# Altium project vme6U_carrier_Cyc_V_SoC.PrjPcb (part 6 of 8)

## Sheet DDS.SchDoc
size 594 x 420 mm; Address1: Address1; Address2: Address2; Address3: Address3; Address4: Address4; SheetNumber: 1; Scale: 1:1; Разраб.: Иванов; Обозначение документа: АБВГ.123456.001 Э3; Пров.: Петров; Утв.: Сидоров; Наименование организации: ОАО "Концерн "МПО-Гидроприбор"; Перв. применение: АБВГ.123456.000; Наименование изделия 1: Плата; Наименование изделия 2: Схема электрическая; Наименование изделия 3: принципиальная; Нач. отд.: Нач. отд.; Фамилия нач. отд.: Сидоров
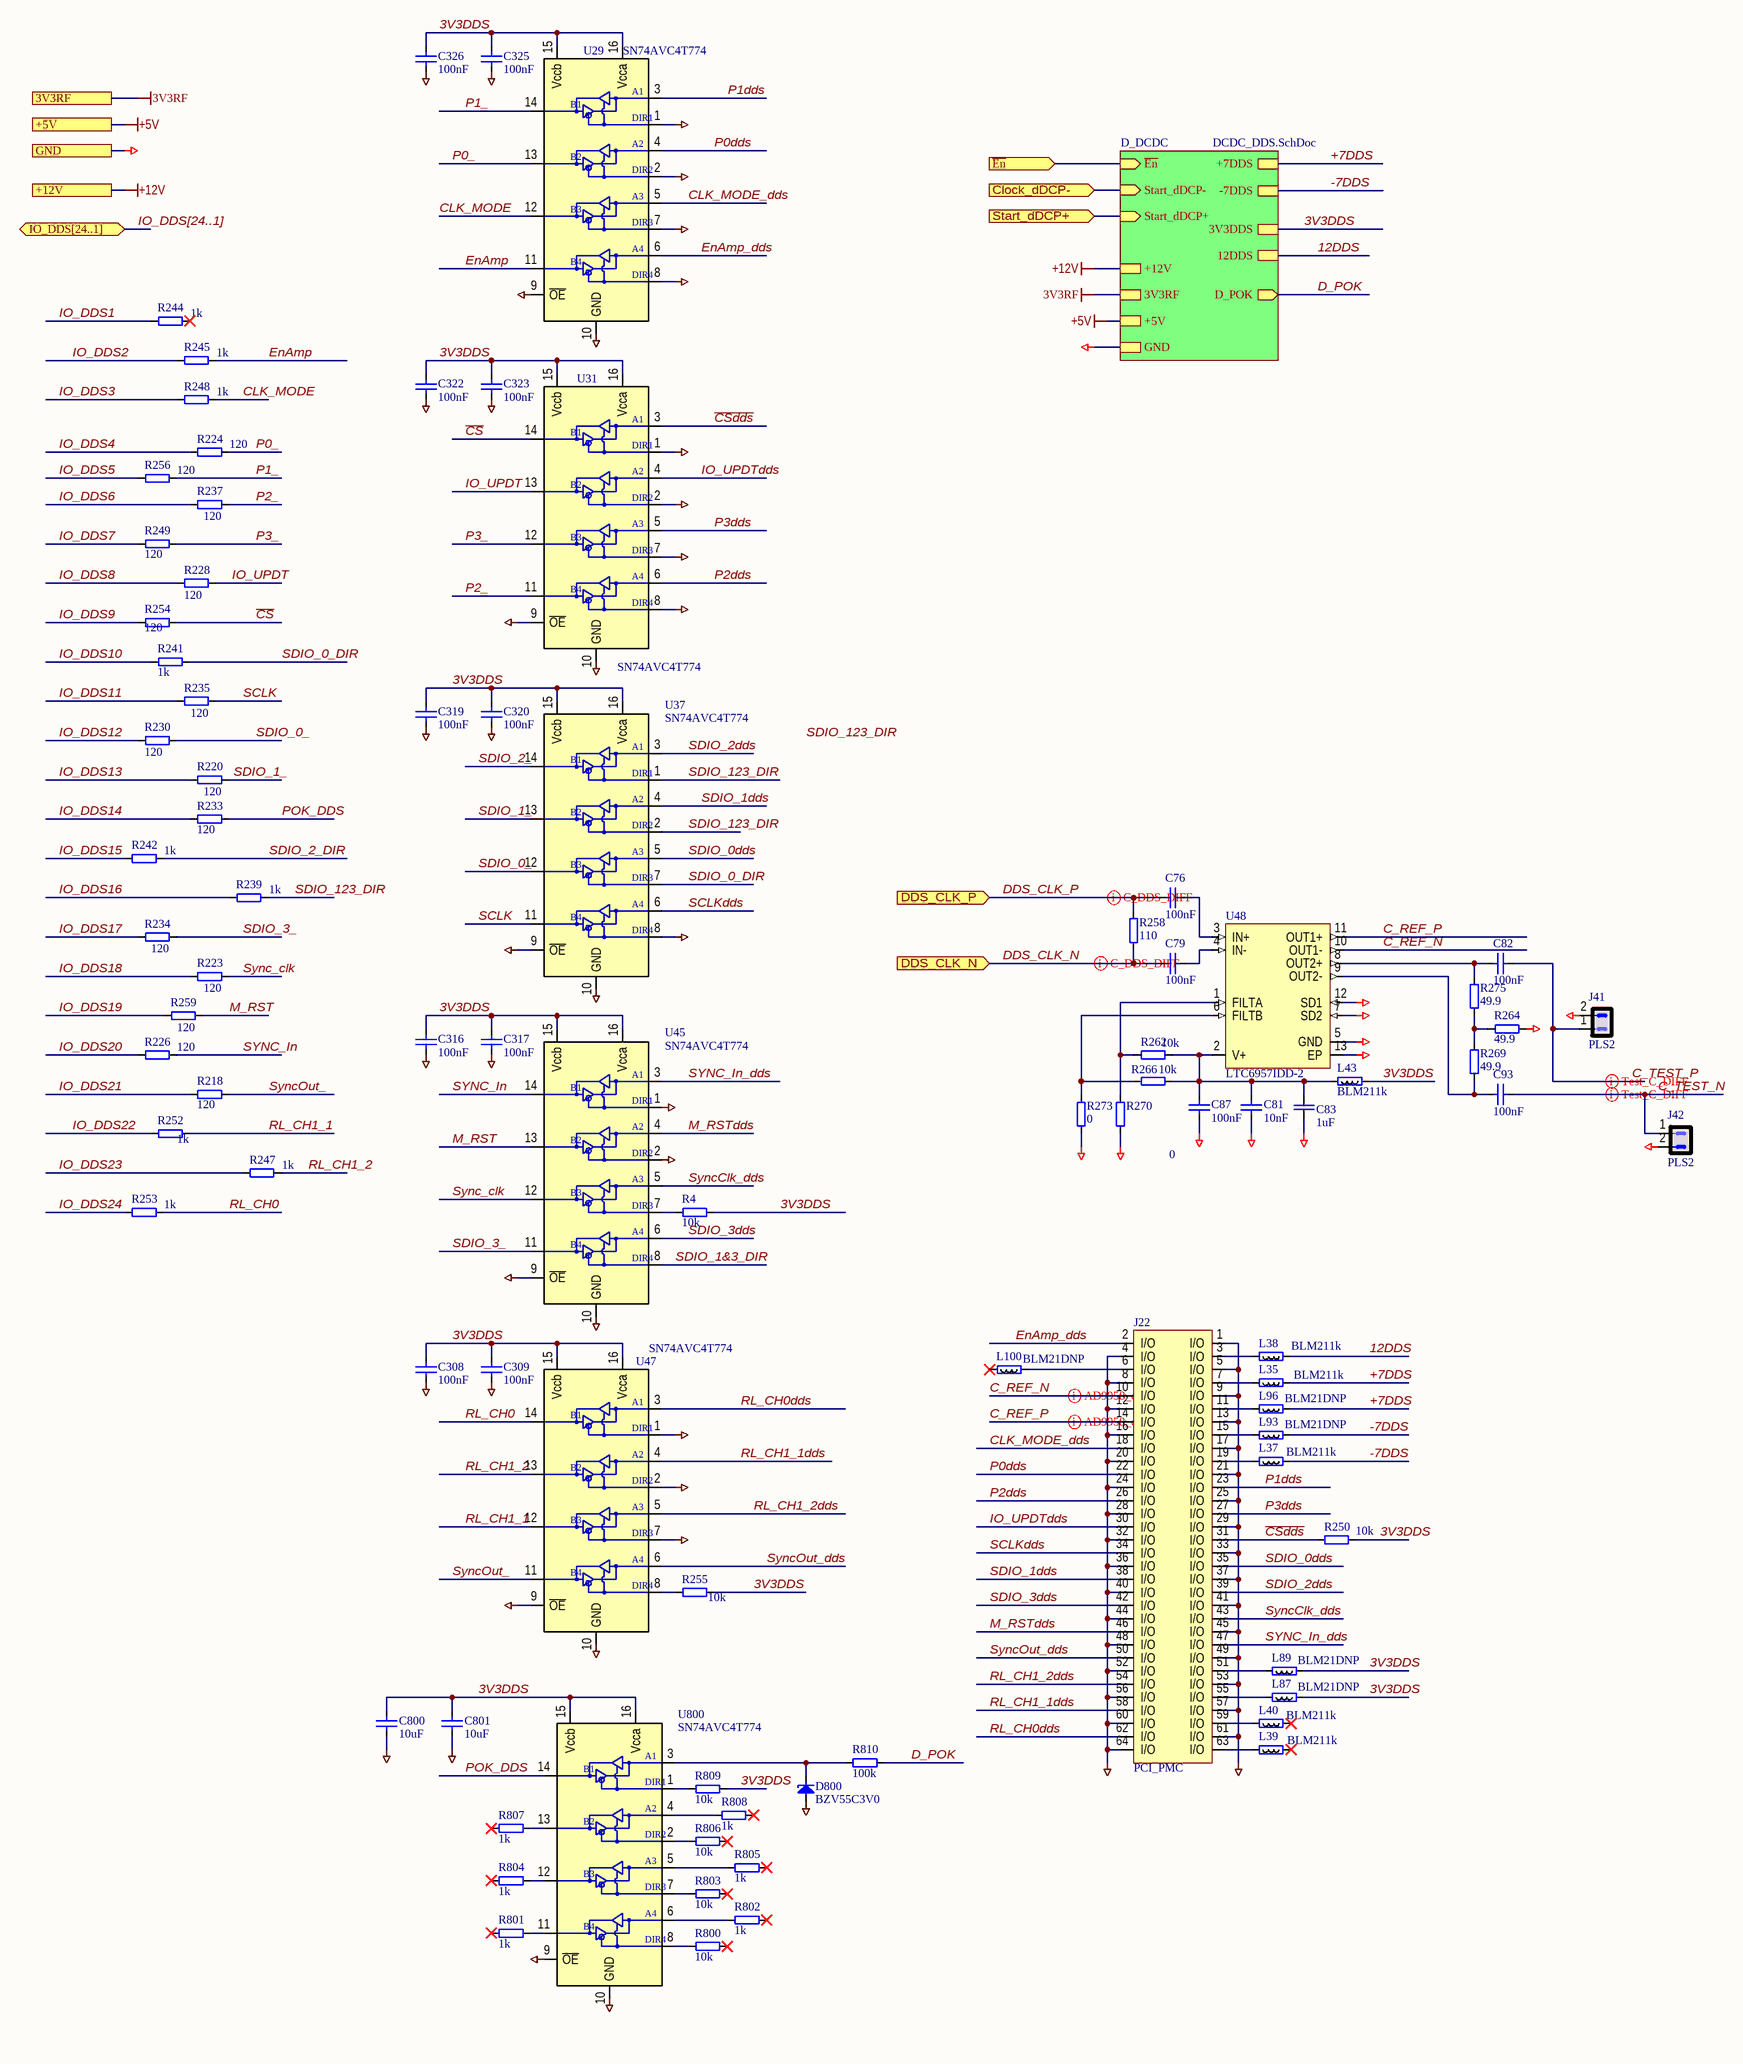
[diagram p21: DDS.SchDoc]

### Parts
(Parts that share a designator on the sheet are numbered #1, #2 ... from top to bottom, then left to right.)
C76#2  100nF  [CAPC1608X87N]
C79#2  100nF  [CAPC1608X87N]
C81#2  10nF  [CAPC1608X87N]
C82  100nF  [CAPC1608X87N]
C83  1uF  [0508]
C87  100nF  [CAPC1608X87N]
C93  100nF  [CAPC1608X87N]
C308  100nF  [SMD0805CAP]
C309  100nF  [SMD0805CAP]
C316  100nF  [SMD0805CAP]
C317  100nF  [SMD0805CAP]
C319  100nF  [SMD0805CAP]
C320  100nF  [SMD0805CAP]
C322  100nF  [SMD0805CAP]
C323  100nF  [SMD0805CAP]
C325  100nF  [SMD0805CAP]
C326  100nF  [SMD0805CAP]
C800  10uF  [SMD0805CAP]
C801  10uF  [SMD0805CAP]
D800  BZV55C3V0  [DIOMELF3516N]
J22  PCI_PMC  [TYCO_120521-1]
J41  PLS2  [PLS2]
J42  PLS2  [PLS2]
L35  BLM211k  [RESC2012X50N]
L37  BLM211k  [RESC2012X50N]
L38  BLM211k  [RESC2012X50N]
L39  BLM211k  [RESC2012X50N]
L40  BLM211k  [RESC2012X50N]
L43  BLM211k  [RESC2012X50N]
L87  BLM21DNP  [RESC2012X50N]
L89  BLM21DNP  [RESC2012X50N]
L93  BLM21DNP  [RESC2012X50N]
L96  BLM21DNP  [RESC2012X50N]
L100  BLM21DNP  [RESC2012X50N]
R4  10k  [SMD0805RES]
R218  120  [SMD0805RES]
R220  120  [SMD0805RES]
R223  120  [SMD0805RES]
R224  120  [SMD0805RES]
R226  120  [SMD0805RES]
R228  120  [SMD0805RES]
R230  120  [SMD0805RES]
R233  120  [SMD0805RES]
R234  120  [SMD0805RES]
R235  120  [SMD0805RES]
R237  120  [SMD0805RES]
R239  1k  [SMD0805RES]
R241  1k  [SMD0805RES]
R242  1k  [SMD0805RES]
R244  1k  [SMD0805RES]
R245  1k  [SMD0805RES]
R247  1k  [SMD0805RES]
R248  1k  [SMD0805RES]
R249  120  [SMD0805RES]
R250  10k  [SMD0805RES]
R252  1k  [SMD0805RES]
R253  1k  [SMD0805RES]
R254  120  [SMD0805RES]
R255  10k  [SMD0805RES]
R256  120  [SMD0805RES]
R258  110  [RESC1608X64N]
R259  120  [SMD0805RES]
R262  10k  [RESC1608X64N]
R264  49.9  [SMD0805RES]
R266  10k  [RESC1608X64N]
R269  49.9  [RESC1608X64N]
R270  0  [RESC1608X64N]
R273  0  [RESC1608X64N]
R275  49.9  [RESC1608X64N]
R800  10k  [SMD0805RES]
R801  1k  [SMD0805RES]
R802  1k  [SMD0805RES]
R803  10k  [SMD0805RES]
R804  1k  [SMD0805RES]
R805  1k  [SMD0805RES]
R806  10k  [SMD0805RES]
R807  1k  [SMD0805RES]
R808  1k  [SMD0805RES]
R809  10k  [SMD0805RES]
R810  100k  [SMD0805RES]
U29  SN74AVC4T774  [TSSOP-16]
U31#2  SN74AVC4T774  [TSSOP-16]
U37#2  SN74AVC4T774  [TSSOP-16]
U45  SN74AVC4T774  [TSSOP-16]
U47  SN74AVC4T774  [TSSOP-16]
U48  LTC6957IDD-2  [DFN13-045]
U800  SN74AVC4T774  [TSSOP-16]

### Sub-sheets
D_DCDC = DCDC_DDS.SchDoc: +7DDS, -7DDS, 3V3DDS, ~{En} (in), Start_dDCP- (in), Start_dDCP+ (in), +5V, GND, 3V3RF, +12V, 12DDS, D_POK (out)

### Ports
3V3RF, +5V, +12V, Clock_dDCP- (in), DDS_CLK_N (in), DDS_CLK_P (in), GND, IO_DDS[24..1] (bidir), Start_dDCP+ (in), ~{En} (in)

### Nets
3V3RF: port 3V3RF, sheet D_DCDC/3V3RF
+5V: port +5V, sheet D_DCDC/+5V  [project net +5VME]
+12V: port +12V, sheet D_DCDC/+12V  [project net +12Vin]
GND: C81#2.1 C83.2 C87.1 C308.1 C309.1 C316.1 C317.1 C319.1 C320.1 C322.1 C323.1 C325.1 C326.1 C800.1 C801.1 D800.2(A) J22.1(I/O) J22.4(I/O) J22.5(I/O) J22.8(I/O) J22.9(I/O) J22.12(I/O) J22.13(I/O) J22.16(I/O) J22.17(I/O) J22.20(I/O) J22.21(I/O) J22.24(I/O) J22.25(I/O) J22.28(I/O) J22.29(I/O) J22.32(I/O) J22.33(I/O) J22.36(I/O) J22.37(I/O) J22.40(I/O) J22.41(I/O) J22.44(I/O) J22.45(I/O) J22.48(I/O) J22.49(I/O) J22.52(I/O) J22.53(I/O) J22.56(I/O) J22.57(I/O) J22.60(I/O) J22.61(I/O) J22.64(I/O) J41.2 J42.2 R264.1 R270.1 R273.1 U29.1(DIR1) U29.2(DIR2) U29.7(DIR3) U29.8(DIR4) U29.9(~{OE}) U29.10(GND) U31#2.1(DIR1) U31#2.2(DIR2) U31#2.7(DIR3) U31#2.8(DIR4) U31#2.9(~{OE}) U31#2.10(GND) U37#2.8(DIR4) U37#2.9(~{OE}) U37#2.10(GND) U45.1(DIR1) U45.2(DIR2) U45.9(~{OE}) U45.10(GND) U47.1(DIR1) U47.2(DIR2) U47.7(DIR3) U47.9(~{OE}) U47.10(GND) U48.5(GND) U48.7(SD2) U48.12(SD1) U48.13(EP) U800.9(~{OE}) U800.10(GND) ; port GND, sheet D_DCDC/GND  [project net POK_int]
3V3DDS: C308.2 C309.2 C316.2 C317.2 C319.2 C320.2 C322.2 C323.2 C325.2 C326.2 C800.2 C801.2 L43.2 L87.2 L89.2 R4.2 R250.2 R255.1 R809.2 U29.15(Vccb) U29.16(Vcca) U31#2.15(Vccb) U31#2.16(Vcca) U37#2.15(Vccb) U37#2.16(Vcca) U45.15(Vccb) U45.16(Vcca) U47.15(Vccb) U47.16(Vcca) U800.15(Vccb) U800.16(Vcca) ; sheet D_DCDC/3V3DDS
12DDS: L38.2 ; sheet D_DCDC/12DDS
+7DDS: L35.2 L96.2 ; sheet D_DCDC/+7DDS
-7DDS: L37.2 L93.2 ; sheet D_DCDC/-7DDS
~{CS}: R254.1 U31#2.14(B1)
~{CSdds}: J22.31(I/O) R250.1 U31#2.3(A1)
~{En}: port ~{En}, sheet D_DCDC/~{En}
C_REF_N: J22.10(I/O) U48.10(OUT1-)
C_REF_P: J22.14(I/O) U48.11(OUT1+)
C_TEST_N: C93.2 J42.1
C_TEST_P: C82.2 J41.1
CLK_MODE: R248.1 U29.12(B3)
CLK_MODE_dds: J22.18(I/O) U29.5(A3)
Clock_dDCP-: port Clock_dDCP-, sheet D_DCDC/Start_dDCP-
D_POK: R810.2 ; sheet D_DCDC/D_POK
DDS_CLK_N: C79#2.1 R258.1 ; port DDS_CLK_N
DDS_CLK_P: C76#2.1 R258.2 ; port DDS_CLK_P
EnAmp: R245.1 U29.11(B4)
EnAmp_dds: J22.2(I/O) U29.6(A4)
IO_DDS1: R244.2  [project net IO_BR16]
IO_DDS2: R245.2  [project net IO_BL20]
IO_DDS3: R248.2  [project net IO_BR17]
IO_DDS4: R224.2  [project net IO_BR18]
IO_DDS5: R256.2  [project net IO_BL21]
IO_DDS6: R237.2  [project net IO_BL22]
IO_DDS7: R249.2  [project net IO_BR19]
IO_DDS8: R228.2  [project net IO_BR20]
IO_DDS9: R254.2  [project net IO_BL23]
IO_DDS10: R241.1  [project net IO_BL24]
IO_DDS11: R235.2  [project net IO_BL25]
IO_DDS12: R230.2  [project net IO_BL26]
IO_DDS13: R220.2  [project net IO_BL27]
IO_DDS14: R233.2  [project net IO_BL28]
IO_DDS15: R242.2  [project net IO_BL29]
IO_DDS16: R239.2  [project net IO_BL30]
IO_DDS17: R234.2  [project net IO_BL31]
IO_DDS18: R223.2  [project net IO_BL32]
IO_DDS19: R259.2  [project net IO_BL33]
IO_DDS20: R226.2  [project net IO_BL34]
IO_DDS21: R218.2  [project net IO_BL35]
IO_DDS22: R252.2  [project net IO_BL36]
IO_DDS23: R247.2  [project net IO_BL37]
IO_DDS24: R253.2  [project net IO_BL38]
IO_UPDT: R228.1 U31#2.13(B2)
IO_UPDTdds: J22.30(I/O) U31#2.4(A2)
M_RST: R259.1 U45.13(B2)
M_RSTdds: J22.46(I/O) U45.4(A2)
P0_: R224.1 U29.13(B2)
P0dds: J22.22(I/O) U29.4(A2)
P1_: R256.1 U29.14(B1)
P1dds: J22.23(I/O) U29.3(A1)
P2_: R237.1 U31#2.11(B4)
P2dds: J22.26(I/O) U31#2.6(A4)
P3_: R249.1 U31#2.12(B3)
P3dds: J22.27(I/O) U31#2.5(A3)
POK_DDS: R233.1 U800.14(B1)
RL_CH0: R253.1 U47.14(B1)
RL_CH0dds: J22.62(I/O) U47.3(A1)
RL_CH1_1: R252.1 U47.12(B3)
RL_CH1_1dds: J22.58(I/O) U47.4(A2)
RL_CH1_2: R247.1 U47.13(B2)
RL_CH1_2dds: J22.54(I/O) U47.5(A3)
SCLK: R235.1 U37#2.11(B4)
SCLKdds: J22.34(I/O) U37#2.6(A4)
SDIO_0_: R230.1 U37#2.12(B3)
SDIO_0_DIR: R241.2 U37#2.7(DIR3)
SDIO_0dds: J22.35(I/O) U37#2.5(A3)
SDIO_1&3_DIR: U45.8(DIR4)
SDIO_1_: R220.1 U37#2.13(B2)
SDIO_1dds: J22.38(I/O) U37#2.4(A2)
SDIO_2_: U37#2.14(B1)
SDIO_2_DIR: R242.1
SDIO_2dds: J22.39(I/O) U37#2.3(A1)
SDIO_3_: R234.1 U45.11(B4)
SDIO_3dds: J22.42(I/O) U45.6(A4)
SDIO_123_DIR: R239.1 U37#2.1(DIR1) U37#2.2(DIR2)
Sync_clk: R223.1 U45.12(B3)
SYNC_In: R226.1 U45.14(B1)
SYNC_In_dds: J22.47(I/O) U45.3(A1)
SyncClk_dds: J22.43(I/O) U45.5(A3)
SyncOut_: R218.1 U47.11(B4)
SyncOut_dds: J22.50(I/O) U47.6(A4)
NetC76#2_2: C76#2.2 U48.3(IN+)
NetC79#2_2: C79#2.2 U48.4(IN-)
NetC81#2_2: C81#2.2 C83.1 C87.2 L43.1 R262.2 R266.2 U48.2(V+)
NetC82_1: C82.1 R275.2 U48.8(OUT2+)
NetC93_1: C93.1 R269.1 U48.9(OUT2-)
NetD800_1: D800.1(C) R810.1 U800.3(A1)
NetJ22_3: J22.3(I/O) L38.1
NetJ22_6: J22.6(I/O) L100.2
NetJ22_7: J22.7(I/O) L35.1
NetJ22_11: J22.11(I/O) L96.1
NetJ22_15: J22.15(I/O) L93.1
NetJ22_19: J22.19(I/O) L37.1
NetJ22_51: J22.51(I/O) L89.1
NetJ22_55: J22.55(I/O) L87.1
NetJ22_59: J22.59(I/O) L40.1
NetJ22_63: J22.63(I/O) L39.1
NetR4_1: R4.1 U45.7(DIR3)
NetR255_2: R255.2 U47.8(DIR4)
NetR262_1: R262.1 R270.2 U48.1(FILTA)
NetR264_2: R264.2 R269.2 R275.1
NetR266_1: R266.1 R273.2 U48.6(FILTB)
NetR800_1: R800.1 U800.8(DIR4)
NetR801_2: R801.2 U800.11(B4)
NetR802_1: R802.1 U800.6(A4)
NetR803_1: R803.1 U800.7(DIR3)
NetR804_2: R804.2 U800.12(B3)
NetR805_1: R805.1 U800.5(A3)
NetR806_1: R806.1 U800.2(DIR2)
NetR807_2: R807.2 U800.13(B2)
NetR808_1: R808.1 U800.4(A2)
NetR809_1: R809.1 U800.1(DIR1)
(unnamed): port Start_dDCP+, sheet D_DCDC/Start_dDCP+

Not connected (* = marked no-connect by the designer): L39 2*; L40 2*; L100 1*; R244 1*; R800 2*; R801 1*; R802 2*; R803 2*; R804 1*; R805 2*; R806 2*; R807 1*; R808 2*

### Buses and harness runs
bus IO_DDS[24..1] = port IO_DDS[24..1]

### Layout directives
differential pair: C_REF_N, C_REF_P, C_TEST_N, C_TEST_P
differential pair; rule Differential Pairs Routing [Pref Gap = 0.175mm    Min Gap  = 0.075mm    Max Gap  = 0.5mmPref Width = 0.25mm    Min Width  = 0.075mm    Max Width  = 0.5mm]: DDS_CLK_N, DDS_CLK_P

### Notes on the sheet
- Labels drawn without touching a wire or pin: SDIO_123_DIR
- Подп. и дата
- Инв. № дубл.
- Взам. инв. №
- Инв. № подл.
- Изм.
- Лист
- № докум.
- Подп.
- Дата
- Копировал
- Формат А2

### Library data of the parts
C76#2 C79#2 C81#2 C82 C87 C93 = C0603: Чип конденсатор 0603; Voltage: 50V; Vendor: Vishay; DielectricType: X5R; SMD Solders: 2; Solder Option: RM; Tolerance: 20%; Pkg: SMD0603; Device: Cap603; Price: 2
  C76#2 C79#2 C82 C87 C93: Value: 100nF
  C81#2: Value: 10nF
C83 = CAP_LLL219R71A105: 1uF; 10V; 0805R; X7R; Low ESL; Reverse geometry; Vendor: muRata; SolderOption: 2; THD Solders: 0; PartField: LLL219R71A105; Pkg: 0508; Value: 1uF; SMD Solders: 2; ClassName: Soldered_BINP
C308 C309 C316 C317 C319 C320 C322 C323 C325 C326 C800 C801 = C0805: Чип конденсатор 0805; Voltage: 25V; Vendor: Vishay; DielectricType: X5R; SMD Solders: 2; Solder Option: RM; Tolerance: 20%; Pkg: SMD0805; Device: Cap0805; Price: 2
  C308 C309 C316 C317 C319 C320 C322 C323 C325 C326: Value: 100nF
  C800 C801: Value: 10uF
D800 = BZV55C: Чип cтабилитрон; Vendor: LGE; Value: 3V0; Voltage: 3V; SMD Solders: 2; Solder Option: RM; Pkg: SOD80; Current: 5; Price: 5; Device: BZV55C; Name to order: BZV55C3V0
J22 = PCI_PMC_M: PCI Mezzanine Connector; IEEE 1386 MainBoard; Manufactuer: TE Connectivity; PartField: 120527-1; SolderOption: 2; Pkg: PMC Male (IEEE 1386); Value: PCI_PMC; Vendor: TE Connectivity
J41 J42 = PLS2: Vendor: Confly; SMD Solders: 0; Solder Option: RM; THD Solders: 2; Price: 1; Device: PLS2
L35 L37-L40 L43 = BLM21: SMD Ferrite bead 0805; Vendor: Vishay; Value: 1k; Pkg: SMD0805; SMD Solders: 2; Solder Option: RM; Price: 10; Device: BLM21
L87 L89 L93 L96 L100 = BLM21: SMD Ferrite bead 0805; Vendor: Vishay; Value: DNP; Pkg: SMD0805; SMD Solders: 2; Solder Option: RM; Price: 10; Device: BLM21
R4 R241 R250 R264 R809 R810 = R0805: Чип резистор 0805; Vendor: Vishay; SMD Solders: 2; Solder Option: RM; TC: 100ppm/C; Tolerance: 1%; Pkg: SMD0805; Pwr: 125mW; Device: Res0805; Price: 2
  R4 R250 R809: Value: 10k
  R241: Value: 1k
  R264: Value: 49.9
  R810: Value: 100k
R218 R220 R223 R224 R226 R228 R230 R233-R235 R237 R239 R242 R244 R245 R247-R249 R252-R256 R259 = R0805: Чип резистор 0805; Vendor: Vishay; SMD Solders: 2; Solder Option: i; TC: 100ppm/C; Tolerance: 1%; Pkg: SMD0805; Pwr: 125mW; Device: Res0805; Price: 2
  R218 R220 R223 R224 R226 R228 R230 R233-R235 R237 R249 R254 R256 R259: Value: 120
  R239 R242 R244 R245 R247 R248 R252 R253: Value: 1k
  R255: Value: 10k
R258 R262 R266 R269 R270 R273 R275 = R0603: Чип резистор 0603; Vendor: Vishay; SMD Solders: 2; Solder Option: RM; TC: 100ppm/C; Tolerance: 1%; Pkg: SMD0603; Pwr: 60mW; Device: Res603; Price: 2
  R258: Value: 110
  R262 R266: Value: 10k
  R269 R275: Value: 49.9
  R270 R273: Value: 0
R800-R808 = R0805: Чип резистор 0805; Vendor: Vishay; SMD Solders: 2; Solder Option: DNP; TC: 100ppm/C; Tolerance: 1%; Pkg: SMD0805; Pwr: 125mW; Device: Res0805; Price: 2
  R800 R803 R806: Value: 10k
  R801 R802 R804 R805 R807 R808: Value: 1k
U29 U31#2 U37#2 U45 U47 U800 = SN74AVC4T774: Двунаправленный буфер; Pkg: TSSOP16; SMD Solders: 16; Solder Option: RM; THD Solders: 0; Vendor: Texas Instruments; Voltage: 1V1.. 3.6V  I/Os are 4.6-V Tolerant; Name to order: SN74AVC4T774PW; Device: SN74AVC4T774; Price: 300
U48 = LTC6957-2: Bufer CMOS in to 2xLVDS out; Vendor: Analog Devices; Pkg: DFN045-13; SMD Solders: 13; Solder Option: outSrc; THD Solders: 0; Current: 72; Voltage: 2.15.. 3.45; Price: 4200; Device: LTC6957IDD-2; Name to order: LTC6957IDD-2

## Sheet DCDC_DDS.SchDoc
size 420 x 297 mm; Address1: Address1; Address2: Address2; Address3: Address3; Address4: Address4; SheetNumber: 1; Scale: 1:1; Разраб.: Иванов; Обозначение документа: АБВГ.123456.001 Э3; Пров.: Петров; Утв.: Сидоров; Наименование организации: ОАО "Концерн "МПО-Гидроприбор"; Перв. применение: АБВГ.123456.000; Наименование изделия 1: Плата; Наименование изделия 2: Схема электрическая; Наименование изделия 3: принципиальная; Нач. отд.: Нач. отд.; Фамилия нач. отд.: Сидоров
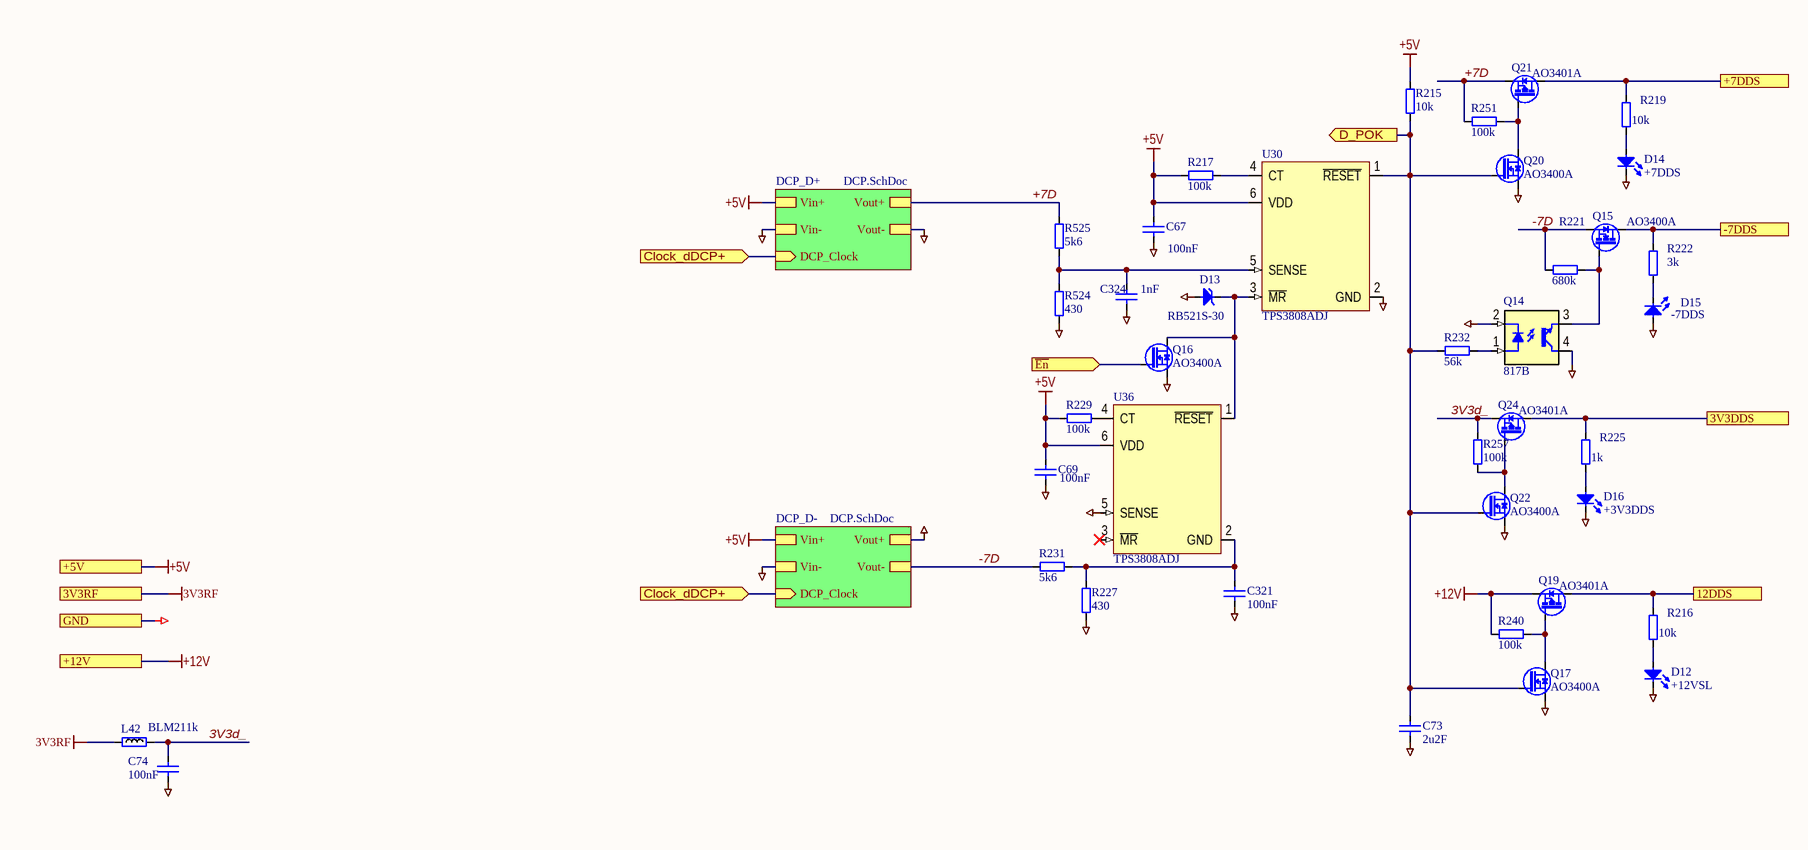
[diagram p22: DCDC_DDS.SchDoc]

### Parts
(Parts that share a designator on the sheet are numbered #1, #2 ... from top to bottom, then left to right.)
C67  100nF  [SMD0805CAP]
C69  100nF  [SMD0805CAP]
C73  2u2F  [SMD0805CAP]
C74  100nF  [SMD0805CAP]
C321  100nF  [SMD0805CAP]
C324  1nF  [SMD0805CAP]
D12  +12VSL  [LED0603]
D13  RB521S-30  [SODFL1608X65N]
D14  +7DDS  [LED0603]
D15  -7DDS  [LED0603]
D16  +3V3DDS  [LED0603]
L42  BLM211k  [RESC2012X50N]
Q14  817B  [DIP4-300]
Q15  AO3400A  [SOT95P229X119-3N]
Q16  AO3400A  [SOT95P229X119-3N]
Q17  AO3400A  [SOT95P229X119-3N]
Q19  AO3401A  [SOT95P229X119-3N]
Q20  AO3400A  [SOT95P229X119-3N]
Q21  AO3401A  [SOT95P229X119-3N]
Q22  AO3400A  [SOT95P229X119-3N]
Q24  AO3401A  [SOT95P229X119-3N]
R215  10k  [SMD0805RES]
R216  10k  [SMD0805RES]
R217  100k  [SMD0805RES]
R219  10k  [SMD0805RES]
R221  680k  [SMD0805RES]
R222  3k  [SMD0805RES]
R225  1k  [SMD0805RES]
R227  430  [SMD0805RES]
R229  100k  [SMD0805RES]
R231  5k6  [SMD0805RES]
R232  56k  [SMD0805RES]
R240  100k  [SMD0805RES]
R251  100k  [SMD0805RES]
R257  100k  [SMD0805RES]
R524  430  [SMD0805RES]
R525  5k6  [SMD0805RES]
U30#2  TPS3808ADJ  [SOT95P270X145-6N]
U36#2  TPS3808ADJ  [SOT95P270X145-6N]

### Sub-sheets
DCP_D+ = DCP.SchDoc: DCP_Clock (in), Vout+, Vout-, Vin-, Vin+
DCP_D- = DCP.SchDoc: DCP_Clock (in), Vout+, Vout-, Vin-, Vin+

### Ports
3V3DDS, 3V3RF, 12DDS, +5V, +7DDS, +12V, -7DDS, Clock_dDCP+ (in), D_POK (out), GND, ~{En} (in)

### Nets
3V3RF: L42.2 ; port 3V3RF
+5V: C67.2 C69.2 R215.1 R217.1 R229.1 U30#2.6(VDD) U36#2.6(VDD) ; port +5V, sheet DCP_D+/Vin+, sheet DCP_D-/Vin+  [project net +5VME]
+12V: Q19.2(S) R240.2 ; port +12V  [project net +12Vin]
GND: C67.1 C69.1 C73.2 C74.1 C321.2 C324.1 D12.1(C) D13.2(A) D14.1(C) D15.2(A) D16.1(C) Q14.2(C) Q14.4(C) Q16.2(S) Q17.2(S) Q20.2(S) Q22.2(S) R227.1 R524.1 U30#2.2(GND) U36#2.5(SENSE) ; port GND, sheet DCP_D+/Vout-, sheet DCP_D+/Vin-, sheet DCP_D-/Vout+, sheet DCP_D-/Vin-  [project net POK_int]
3V3d_: C74.2 L42.1 Q24.2(S) R257.1
3V3DDS: Q24.3(D) R225.2 ; port 3V3DDS
12DDS: Q19.3(D) R216.2 ; port 12DDS
+7D: Q21.2(S) R251.2 R525.1 ; sheet DCP_D+/Vout+
+7DDS: Q21.3(D) R219.2 ; port +7DDS
-7D: Q15.2(S) R221.2 R231.1 ; sheet DCP_D-/Vout-
-7DDS: Q15.3(D) R222.2 ; port -7DDS
~{En}: Q16.1(G) ; port ~{En}
D_POK: C73.1 Q17.1(G) Q20.1(G) Q22.1(G) R215.2 R232.1 U30#2.1(~{RESET}) ; port D_POK
NetC321_1: C321.1 R227.2 R231.2 U36#2.2(GND)
NetC324_2: C324.2 R524.2 R525.2 U30#2.5(SENSE)
NetD12_2: D12.2(A) R216.1
NetD13_1: D13.1(C) Q16.3(D) U30#2.3(~{MR}) U36#2.1(~{RESET})
NetD14_2: D14.2(A) R219.1
NetD15_1: D15.1(C) R222.1
NetD16_2: D16.2(A) R225.1
NetQ10_DCP_D+_1: port Clock_dDCP+, sheet DCP_D+/DCP_Clock, sheet DCP_D-/DCP_Clock
NetQ14_1: Q14.1(A) R232.2
NetQ14_3: Q14.3(E) Q15.1(G) R221.1
NetQ17_3: Q17.3(D) Q19.1(G) R240.1
NetQ20_3: Q20.3(D) Q21.1(G) R251.1
NetQ22_3: Q22.3(D) Q24.1(G) R257.2
NetR217_2: R217.2 U30#2.4(CT)
NetR229_2: R229.2 U36#2.4(CT)

Not connected (* = marked no-connect by the designer): U36#2 3(~{MR})*

### Notes on the sheet
- Подп. и дата
- Инв. № дубл.
- Взам. инв. №
- Инв. № подл.
- Изм.
- Лист
- № докум.
- Подп.
- Дата
- Копировал
- Формат А3

### Library data of the parts
C67 C69 C73 C74 C321 C324 = C0805: as C308 on sheet DDS; Price: 2
  C67 C69 C74 C321: Value: 100nF
  C73: Value: 2u2F
  C324: Value: 1nF
D12 D14-D16 = LED0603: Чип светодиод 0603; Vendor: KB; SMD Solders: 2; Solder Option: RM; Pkg: SMD0603; Price: 10; Device: LED0603
  D12: Value: +12VSL
  D14: Value: +7DDS
  D15: Value: -7DDS
  D16: Value: +3V3DDS
D13 = RB521S-30: Чип Шоттки диод; Vendor: CTK; Voltage: 30V; SMD Solders: 2; Solder Option: RM; Pkg: SOD523; Price: 5; Device: RB521S-30; Name to order: RB521S-30
L42 = BLM21: as L35 on sheet DDS; Price: 10; Device: BLM21
Q14 = 817B: Optotransistor; Pkg: DIP4; SMD Solders: 0; Solder Option: RM; THD Solders: 4; Vendor: UMW; Voltage: 35V; Device: 817B; Price: 10; Name to order: 817B; Current: 0
Q15-Q17 Q20 Q22 = AO3400A: NMOS; Vendor: UMW; Pkg: SOT23; SMD Solders: 3; Solder Option: RM; Voltage: 30V; Price: 10; Device: AO3400A; Name to order: AO3400A
Q19 Q21 Q24 = AO3401A: PMOS; Vendor: UMW; Pkg: SOT23; SMD Solders: 3; Solder Option: RM; THD Solders: 0; Voltage: -30V; Price: 10; Device: AO3401A; Name to order: AO3401A
R215-R217 R219 R221 R222 R225 R227 R229 R231 R232 R240 R251 R257 R524 R525 = R0805: as R4 on sheet DDS; Price: 2
  R215 R216 R219: Value: 10k
  R217 R229 R240 R251 R257: Value: 100k
  R221: Value: 680k
  R222: Value: 3k
  R225: Value: 1k
  R227 R524: Value: 430
  R231 R525: Value: 5k6
  R232: Value: 56k
U30#2 U36#2 = TPS3808: Supervisory Circuit. Low-Quiescent-Current, Programmable-Delay; Vendor: Texas Instruments; Value: ADJ; Pkg: SOT23-6; SMD Solders: 6; Solder Option: RM; THD Solders: 0; Name to order: TPS3808G01DBV; Current: 6uA; thVoltage: 400mV; Price: 200; Device: TPS3808

## Sheet SlowChans.SchDoc
size 594 x 420 mm; Address1: Address1; Address2: Address2; Address3: Address3; Address4: Address4; SheetNumber: 1; Scale: 1:1; Разраб.: Иванов; Обозначение документа: АБВГ.123456.001 Э3; Пров.: Петров; Утв.: Сидоров; Наименование организации: ОАО "Концерн "МПО-Гидроприбор"; Перв. применение: АБВГ.123456.000; Наименование изделия 1: Плата; Наименование изделия 2: Схема электрическая; Наименование изделия 3: принципиальная; Нач. отд.: Нач. отд.; Фамилия нач. отд.: Сидоров
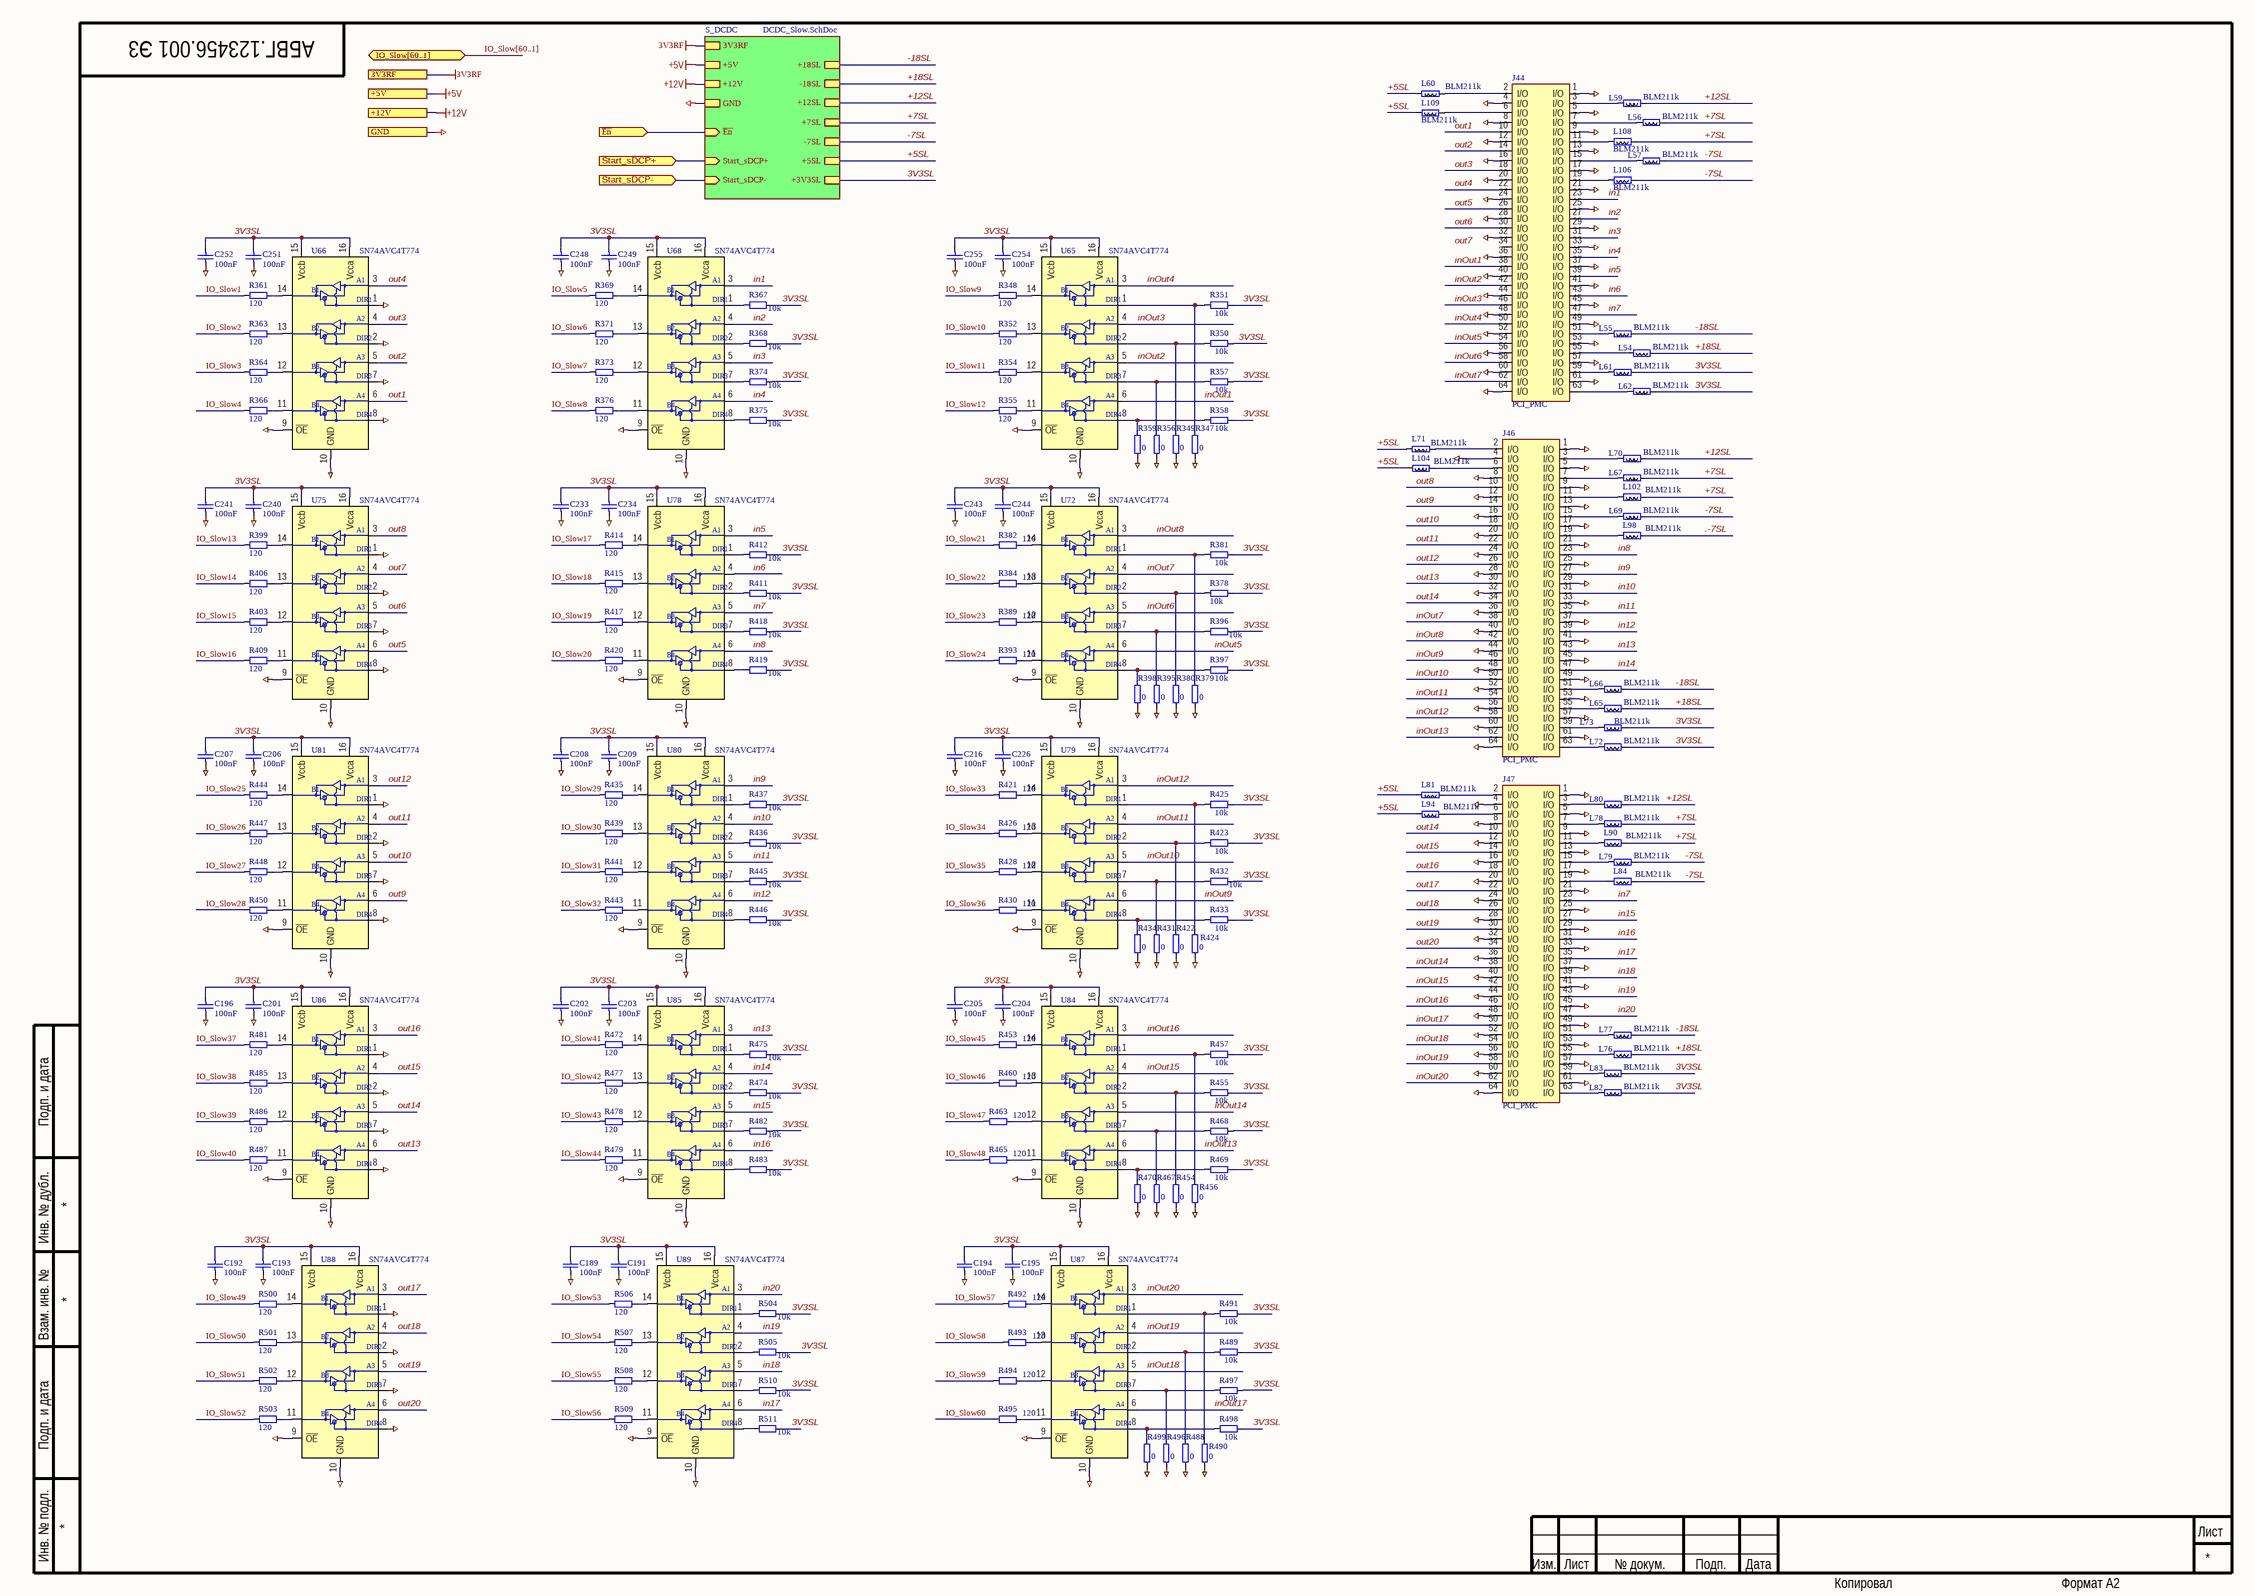
[diagram p23: SlowChans.SchDoc]

### Parts
(Parts that share a designator on the sheet are numbered #1, #2 ... from top to bottom, then left to right.)
C189#2  100nF  [SMD0805CAP]
C191#2  100nF  [SMD0805CAP]
C192#2  100nF  [SMD0805CAP]
C193#2  100nF  [SMD0805CAP]
C194#2  100nF  [SMD0805CAP]
C195#2  100nF  [SMD0805CAP]
C196#2  100nF  [SMD0805CAP]
C201#2  100nF  [SMD0805CAP]
C202  100nF  [SMD0805CAP]
C203  100nF  [SMD0805CAP]
C204  100nF  [SMD0805CAP]
C205  100nF  [SMD0805CAP]
C206  100nF  [SMD0805CAP]
C207  100nF  [SMD0805CAP]
C208  100nF  [SMD0805CAP]
C209  100nF  [SMD0805CAP]
C216  100nF  [SMD0805CAP]
C226  100nF  [SMD0805CAP]
C233  100nF  [SMD0805CAP]
C234  100nF  [SMD0805CAP]
C240  100nF  [SMD0805CAP]
C241  100nF  [SMD0805CAP]
C243  100nF  [SMD0805CAP]
C244  100nF  [SMD0805CAP]
C248  100nF  [SMD0805CAP]
C249  100nF  [SMD0805CAP]
C251  100nF  [SMD0805CAP]
C252  100nF  [SMD0805CAP]
C254  100nF  [SMD0805CAP]
C255  100nF  [SMD0805CAP]
J44  PCI_PMC  [TYCO_120521-1]
J46  PCI_PMC  [TYCO_120521-1]
J47  PCI_PMC  [TYCO_120521-1]
L54  BLM211k  [RESC2012X50N]
L55  BLM211k  [RESC2012X50N]
L56  BLM211k  [RESC2012X50N]
L57  BLM211k  [RESC2012X50N]
L59  BLM211k  [RESC2012X50N]
L60  BLM211k  [RESC2012X50N]
L61  BLM211k  [RESC2012X50N]
L62  BLM211k  [RESC2012X50N]
L65  BLM211k  [RESC2012X50N]
L66  BLM211k  [RESC2012X50N]
L67  BLM211k  [RESC2012X50N]
L69  BLM211k  [RESC2012X50N]
L70  BLM211k  [RESC2012X50N]
L71  BLM211k  [RESC2012X50N]
L72  BLM211k  [RESC2012X50N]
L73  BLM211k  [RESC2012X50N]
L76  BLM211k  [RESC2012X50N]
L77  BLM211k  [RESC2012X50N]
L78  BLM211k  [RESC2012X50N]
L79  BLM211k  [RESC2012X50N]
L80  BLM211k  [RESC2012X50N]
L81  BLM211k  [RESC2012X50N]
L82  BLM211k  [RESC2012X50N]
L83  BLM211k  [RESC2012X50N]
L84  BLM211k  [RESC2012X50N]
L90  BLM211k  [RESC2012X50N]
L94  BLM211k  [RESC2012X50N]
L98  BLM211k  [RESC2012X50N]
L102  BLM211k  [RESC2012X50N]
L104  BLM211k  [RESC2012X50N]
L106  BLM211k  [RESC2012X50N]
L108  BLM211k  [RESC2012X50N]
L109  BLM211k  [RESC2012X50N]
R347  0  [SMD0805RES]
R348  120  [SMD0805RES]
R349  0  [SMD0805RES]
R350  10k  [SMD0805RES]
R351  10k  [SMD0805RES]
R352  120  [SMD0805RES]
R354  120  [SMD0805RES]
R355  120  [SMD0805RES]
R356  0  [SMD0805RES]
R357  10k  [SMD0805RES]
R358  10k  [SMD0805RES]
R359  0  [SMD0805RES]
R361  120  [SMD0805RES]
R363  120  [SMD0805RES]
R364  120  [SMD0805RES]
R366  120  [SMD0805RES]
R367  10k  [SMD0805RES]
R368  10k  [SMD0805RES]
R369  120  [SMD0805RES]
R371  120  [SMD0805RES]
R373  120  [SMD0805RES]
R374  10k  [SMD0805RES]
R375  10k  [SMD0805RES]
R376  120  [SMD0805RES]
R378  10k  [SMD0805RES]
R379  0  [SMD0805RES]
R380  0  [SMD0805RES]
R381  10k  [SMD0805RES]
R382  120  [SMD0805RES]
R384  120  [SMD0805RES]
R389  120  [SMD0805RES]
R393  120  [SMD0805RES]
R395  0  [SMD0805RES]
R396  10k  [SMD0805RES]
R397  10k  [SMD0805RES]
R398  0  [SMD0805RES]
R399  120  [SMD0805RES]
R403  120  [SMD0805RES]
R406  120  [SMD0805RES]
R409  120  [SMD0805RES]
R411  10k  [SMD0805RES]
R412  10k  [SMD0805RES]
R414  120  [SMD0805RES]
R415  120  [SMD0805RES]
R417  120  [SMD0805RES]
R418  10k  [SMD0805RES]
R419  10k  [SMD0805RES]
R420  120  [SMD0805RES]
R421  120  [SMD0805RES]
R422  0  [SMD0805RES]
R423  10k  [SMD0805RES]
R424  0  [SMD0805RES]
R425  10k  [SMD0805RES]
R426  120  [SMD0805RES]
R428  120  [SMD0805RES]
R430  120  [SMD0805RES]
R431  0  [SMD0805RES]
R432  10k  [SMD0805RES]
R433  10k  [SMD0805RES]
R434  0  [SMD0805RES]
R435  120  [SMD0805RES]
R436  10k  [SMD0805RES]
R437  10k  [SMD0805RES]
R439  120  [SMD0805RES]
R441  120  [SMD0805RES]
R443  120  [SMD0805RES]
R444  120  [SMD0805RES]
R445  10k  [SMD0805RES]
R446  10k  [SMD0805RES]
R447  120  [SMD0805RES]
R448  120  [SMD0805RES]
R450  120  [SMD0805RES]
R453  120  [SMD0805RES]
R454  0  [SMD0805RES]
R455  10k  [SMD0805RES]
R456  0  [SMD0805RES]
R457  10k  [SMD0805RES]
R460  120  [SMD0805RES]
R463  120  [SMD0805RES]
R465  120  [SMD0805RES]
R467  0  [SMD0805RES]
R468  10k  [SMD0805RES]
R469  10k  [SMD0805RES]
R470  0  [SMD0805RES]
R472  120  [SMD0805RES]
R474  10k  [SMD0805RES]
R475  10k  [SMD0805RES]
R477  120  [SMD0805RES]
R478  120  [SMD0805RES]
R479  120  [SMD0805RES]
R481  120  [SMD0805RES]
R482  10k  [SMD0805RES]
R483  10k  [SMD0805RES]
R485  120  [SMD0805RES]
R486  120  [SMD0805RES]
R487  120  [SMD0805RES]
R488  0  [SMD0805RES]
R489  10k  [SMD0805RES]
R490  0  [SMD0805RES]
R491  10k  [SMD0805RES]
R492  120  [SMD0805RES]
R493  120  [SMD0805RES]
R494  120  [SMD0805RES]
R495  120  [SMD0805RES]
R496  0  [SMD0805RES]
R497  10k  [SMD0805RES]
R498  10k  [SMD0805RES]
R499  0  [SMD0805RES]
R500  120  [SMD0805RES]
R501  120  [SMD0805RES]
R502  120  [SMD0805RES]
R503  120  [SMD0805RES]
R504  10k  [SMD0805RES]
R505  10k  [SMD0805RES]
R506  120  [SMD0805RES]
R507  120  [SMD0805RES]
R508  120  [SMD0805RES]
R509  120  [SMD0805RES]
R510  10k  [SMD0805RES]
R511  10k  [SMD0805RES]
U65  SN74AVC4T774  [TSSOP-16]
U66  SN74AVC4T774  [TSSOP-16]
U68  SN74AVC4T774  [TSSOP-16]
U72  SN74AVC4T774  [TSSOP-16]
U75  SN74AVC4T774  [TSSOP-16]
U78  SN74AVC4T774  [TSSOP-16]
U79  SN74AVC4T774  [TSSOP-16]
U80  SN74AVC4T774  [TSSOP-16]
U81  SN74AVC4T774  [TSSOP-16]
U84  SN74AVC4T774  [TSSOP-16]
U85  SN74AVC4T774  [TSSOP-16]
U86  SN74AVC4T774  [TSSOP-16]
U87  SN74AVC4T774  [TSSOP-16]
U88  SN74AVC4T774  [TSSOP-16]
U89  SN74AVC4T774  [TSSOP-16]

### Sub-sheets
S_DCDC = DCDC_Slow.SchDoc: +18SL, -18SL, +12SL, +7SL, +3V3SL, +5SL, -7SL, ~{En} (in), Start_sDCP+ (in), Start_sDCP- (in), +5V, +12V, GND, 3V3RF

### Ports
3V3RF, +5V, +12V, GND, IO_Slow[60..1] (bidir), Start_sDCP+ (in), Start_sDCP- (in), ~{En} (in)

### Nets
3V3RF: port 3V3RF, sheet S_DCDC/3V3RF
+5V: port +5V, sheet S_DCDC/+5V  [project net +5VME]
+12V: port +12V, sheet S_DCDC/+12V  [project net +12Vin]
GND: C189#2.1 C191#2.1 C192#2.1 C193#2.1 C194#2.1 C195#2.1 C196#2.1 C201#2.1 C202.1 C203.1 C204.1 C205.1 C206.1 C207.1 C208.1 C209.1 C216.1 C226.1 C233.1 C234.1 C240.1 C241.1 C243.1 C244.1 C248.1 C249.1 C251.1 C252.1 C254.1 C255.1 J44.1(I/O) J44.4(I/O) J44.5(I/O) J44.8(I/O) J44.9(I/O) J44.12(I/O) J44.13(I/O) J44.16(I/O) J44.17(I/O) J44.20(I/O) J44.21(I/O) J44.24(I/O) J44.25(I/O) J44.28(I/O) J44.29(I/O) J44.32(I/O) J44.33(I/O) J44.36(I/O) J44.37(I/O) J44.40(I/O) J44.41(I/O) J44.44(I/O) J44.45(I/O) J44.48(I/O) J44.49(I/O) J44.52(I/O) J44.53(I/O) J44.56(I/O) J44.57(I/O) J44.60(I/O) J44.61(I/O) J44.64(I/O) J46.1(I/O) J46.4(I/O) J46.5(I/O) J46.8(I/O) J46.9(I/O) J46.12(I/O) J46.13(I/O) J46.16(I/O) J46.17(I/O) J46.20(I/O) J46.21(I/O) J46.24(I/O) J46.25(I/O) J46.28(I/O) J46.29(I/O) J46.32(I/O) J46.33(I/O) J46.36(I/O) J46.37(I/O) J46.40(I/O) J46.41(I/O) J46.44(I/O) J46.45(I/O) J46.48(I/O) J46.49(I/O) J46.52(I/O) J46.53(I/O) J46.56(I/O) J46.57(I/O) J46.60(I/O) J46.61(I/O) J46.64(I/O) J47.1(I/O) J47.4(I/O) J47.5(I/O) J47.8(I/O) J47.9(I/O) J47.12(I/O) J47.13(I/O) J47.16(I/O) J47.17(I/O) J47.20(I/O) J47.21(I/O) J47.24(I/O) J47.25(I/O) J47.28(I/O) J47.29(I/O) J47.32(I/O) J47.33(I/O) J47.36(I/O) J47.37(I/O) J47.40(I/O) J47.41(I/O) J47.44(I/O) J47.45(I/O) J47.48(I/O) J47.49(I/O) J47.52(I/O) J47.53(I/O) J47.56(I/O) J47.57(I/O) J47.60(I/O) J47.61(I/O) J47.64(I/O) R347.1 R349.2 R356.2 R359.2 R379.1 R380.2 R395.2 R398.2 R422.2 R424.1 R431.2 R434.2 R454.2 R456.1 R467.2 R470.2 R488.2 R490.1 R496.2 R499.2 U65.9(~{OE}) U65.10(GND) U66.1(DIR1) U66.2(DIR2) U66.7(DIR3) U66.8(DIR4) U66.9(~{OE}) U66.10(GND) U68.9(~{OE}) U68.10(GND) U72.9(~{OE}) U72.10(GND) U75.1(DIR1) U75.2(DIR2) U75.7(DIR3) U75.8(DIR4) U75.9(~{OE}) U75.10(GND) U78.9(~{OE}) U78.10(GND) U79.9(~{OE}) U79.10(GND) U80.9(~{OE}) U80.10(GND) U81.1(DIR1) U81.2(DIR2) U81.7(DIR3) U81.8(DIR4) U81.9(~{OE}) U81.10(GND) U84.9(~{OE}) U84.10(GND) U85.9(~{OE}) U85.10(GND) U86.1(DIR1) U86.2(DIR2) U86.7(DIR3) U86.8(DIR4) U86.9(~{OE}) U86.10(GND) U87.9(~{OE}) U87.10(GND) U88.1(DIR1) U88.2(DIR2) U88.7(DIR3) U88.8(DIR4) U88.9(~{OE}) U88.10(GND) U89.9(~{OE}) U89.10(GND) ; port GND, sheet S_DCDC/GND  [project net POK_int]
3V3SL: C189#2.2 C191#2.2 C192#2.2 C193#2.2 C194#2.2 C195#2.2 C196#2.2 C201#2.2 C202.2 C203.2 C204.2 C205.2 C206.2 C207.2 C208.2 C209.2 C216.2 C226.2 C233.2 C234.2 C240.2 C241.2 C243.2 C244.2 C248.2 C249.2 C251.2 C252.2 C254.2 C255.2 L61.2 L62.2 L72.2 L73.2 L82.2 L83.2 R350.1 R351.1 R357.1 R358.1 R367.1 R368.1 R374.1 R375.1 R378.1 R381.1 R396.1 R397.1 R411.1 R412.1 R418.1 R419.1 R423.1 R425.1 R432.1 R433.1 R436.1 R437.1 R445.1 R446.1 R455.1 R457.1 R468.1 R469.1 R474.1 R475.1 R482.1 R483.1 R489.1 R491.1 R497.1 R498.1 R504.1 R505.1 R510.1 R511.1 U65.15(Vccb) U65.16(Vcca) U66.15(Vccb) U66.16(Vcca) U68.15(Vccb) U68.16(Vcca) U72.15(Vccb) U72.16(Vcca) U75.15(Vccb) U75.16(Vcca) U78.15(Vccb) U78.16(Vcca) U79.15(Vccb) U79.16(Vcca) U80.15(Vccb) U80.16(Vcca) U81.15(Vccb) U81.16(Vcca) U84.15(Vccb) U84.16(Vcca) U85.15(Vccb) U85.16(Vcca) U86.15(Vccb) U86.16(Vcca) U87.15(Vccb) U87.16(Vcca) U88.15(Vccb) U88.16(Vcca) U89.15(Vccb) U89.16(Vcca) ; sheet S_DCDC/+3V3SL
+5SL: L60.2 L71.2 L81.2 L94.1 L104.1 L109.1 ; sheet S_DCDC/+5SL
+7SL: L56.2 L67.2 L78.2 L90.2 L102.2 L108.2 ; sheet S_DCDC/+7SL
+12SL: L59.2 L70.2 L80.2 ; sheet S_DCDC/+12SL
+18SL: L54.2 L65.2 L76.2 ; sheet S_DCDC/-18SL
-7SL: L57.2 L69.2 L79.2 L84.2 L106.2 ; sheet S_DCDC/-7SL
-18SL: L55.2 L66.2 L77.2 ; sheet S_DCDC/+18SL
.-7SL: L98.2
~{En}: port ~{En}, sheet S_DCDC/~{En}
in1: J44.23(I/O) U68.3(A1)
in2: J44.27(I/O) U68.4(A2)
in3: J44.31(I/O) U68.5(A3)
in4: J44.35(I/O) U68.6(A4)
in5: J44.39(I/O) U78.3(A1)
in6: J44.43(I/O) U78.4(A2)
in7: J44.47(I/O) J47.23(I/O) U78.5(A3)
in8: J46.23(I/O) U78.6(A4)
in9: J46.27(I/O) U80.3(A1)
in10: J46.31(I/O) U80.4(A2)
in11: J46.35(I/O) U80.5(A3)
in12: J46.39(I/O) U80.6(A4)
in13: J46.43(I/O) U85.3(A1)
in14: J46.47(I/O) U85.4(A2)
in15: J47.27(I/O) U85.5(A3)
in16: J47.31(I/O) U85.6(A4)
in17: J47.35(I/O) U89.6(A4)
in18: J47.39(I/O) U89.5(A3)
in19: J47.43(I/O) U89.4(A2)
in20: J47.47(I/O) U89.3(A1)
inOut1: J44.38(I/O) U65.6(A4)
inOut2: J44.42(I/O) U65.5(A3)
inOut3: J44.46(I/O) U65.4(A2)
inOut4: J44.50(I/O) U65.3(A1)
inOut5: J44.54(I/O) U72.6(A4)
inOut6: J44.58(I/O) U72.5(A3)
inOut7: J44.62(I/O) J46.38(I/O) U72.4(A2)
inOut8: J46.42(I/O) U72.3(A1)
inOut9: J46.46(I/O) U79.6(A4)
inOut10: J46.50(I/O) U79.5(A3)
inOut11: J46.54(I/O) U79.4(A2)
inOut12: J46.58(I/O) U79.3(A1)
inOut13: J46.62(I/O) U84.6(A4)
inOut14: J47.38(I/O) U84.5(A3)
inOut15: J47.42(I/O) U84.4(A2)
inOut16: J47.46(I/O) U84.3(A1)
inOut17: J47.50(I/O) U87.6(A4)
inOut18: J47.54(I/O) U87.5(A3)
inOut19: J47.58(I/O) U87.4(A2)
inOut20: J47.62(I/O) U87.3(A1)
IO_Slow1: R361.2  [project net IO_BL3]
IO_Slow2: R363.2  [project net IO_BL4]
IO_Slow3: R364.2  [project net IO_BL5]
IO_Slow4: R366.2  [project net IO_BL6]
IO_Slow5: R369.2  [project net IO_BL7]
IO_Slow6: R371.2  [project net IO_BL8]
IO_Slow7: R373.2  [project net IO_BL9]
IO_Slow8: R376.2  [project net IO_BL10]
IO_Slow9: R348.2  [project net IO_BL11]
IO_Slow10: R352.2  [project net IO_BL12]
IO_Slow11: R354.2  [project net IO_BL13]
IO_Slow12: R355.2  [project net IO_BL14]
IO_Slow13: R399.2  [project net IO_BL15]
IO_Slow14: R406.2  [project net IO_BL16]
IO_Slow15: R403.2  [project net IO_CR1]
IO_Slow16: R409.2  [project net IO_CR2]
IO_Slow17: R414.2  [project net IO_CR3]
IO_Slow18: R415.1  [project net IO_CR4]
IO_Slow19: R417.2  [project net IO_CR5]
IO_Slow20: R420.2  [project net IO_CR6]
IO_Slow21: R382.2  [project net IO_CR7]
IO_Slow22: R384.2  [project net IO_CR8]
IO_Slow23: R389.2  [project net IO_CR9]
IO_Slow24: R393.2  [project net IO_CR10]
IO_Slow25: R444.2  [project net IO_CR11]
IO_Slow26: R447.2  [project net IO_CR12]
IO_Slow27: R448.2  [project net IO_CR13]
IO_Slow28: R450.2  [project net IO_CR14]
IO_Slow29: R435.2  [project net IO_CR15]
IO_Slow30: R439.2  [project net IO_CR16]
IO_Slow31: R441.2  [project net IO_CR17]
IO_Slow32: R443.2  [project net IO_CR18]
IO_Slow33: R421.2  [project net IO_CR19]
IO_Slow34: R426.2  [project net IO_CR20]
IO_Slow35: R428.2  [project net IO_CR_FX1]
IO_Slow36: R430.2  [project net IO_CR_FX2]
IO_Slow37: R481.2  [project net IO_CR_FX3]
IO_Slow38: R485.2  [project net IO_CR_FX4]
IO_Slow39: R486.2  [project net IO_CR_FX5]
IO_Slow40: R487.2  [project net IO_CR_FX6]
IO_Slow41: R472.2  [project net IO_CR_FX7]
IO_Slow42: R477.2  [project net IO_CR_FX8]
IO_Slow43: R478.2  [project net IO_CR_FX9]
IO_Slow44: R479.2  [project net IO_CR_FX10]
IO_Slow45: R453.2  [project net IO_CR_FX11]
IO_Slow46: R460.2  [project net IO_CR_FX12]
IO_Slow47: R463.2  [project net IO_CR_FX13]
IO_Slow48: R465.2  [project net IO_CR_FX14]
IO_Slow49: R500.2  [project net IO_CR_FX15]
IO_Slow50: R501.2  [project net IO_CR_FX16]
IO_Slow51: R502.2  [project net IO_CL_FX1]
IO_Slow52: R503.2  [project net IO_CL_FX2]
IO_Slow53: R506.2  [project net IO_CL_FX3]
IO_Slow54: R507.2  [project net IO_CL_FX4]
IO_Slow55: R508.2  [project net IO_CL_FX5]
IO_Slow56: R509.2  [project net IO_CL_FX6]
IO_Slow57: R492.2  [project net IO_CL_FX7]
IO_Slow58: R493.2  [project net IO_CL_FX8]
IO_Slow59: R494.2  [project net IO_CL_FX9]
IO_Slow60: R495.2  [project net IO_CL_FX10]
out1: J44.10(I/O) U66.6(A4)
out2: J44.14(I/O) U66.5(A3)
out3: J44.18(I/O) U66.4(A2)
out4: J44.22(I/O) U66.3(A1)
out5: J44.26(I/O) U75.6(A4)
out6: J44.30(I/O) U75.5(A3)
out7: U75.4(A2)
out8: J46.10(I/O) U75.3(A1)
out9: J46.14(I/O) U81.6(A4)
out10: J46.18(I/O) U81.5(A3)
out11: J46.22(I/O) U81.4(A2)
out12: J46.26(I/O) U81.3(A1)
out13: J46.30(I/O) U86.6(A4)
out14: J46.34(I/O) J47.10(I/O) U86.5(A3)
out15: J47.14(I/O) U86.4(A2)
out16: J47.18(I/O) U86.3(A1)
out17: J47.22(I/O) U88.3(A1)
out18: J47.26(I/O) U88.4(A2)
out19: J47.30(I/O) U88.5(A3)
out20: J47.34(I/O) U88.6(A4)
NetJ44_2: J44.2(I/O) L60.1
NetJ44_3: J44.3(I/O) L59.1
NetJ44_6: J44.6(I/O) L109.2
NetJ44_7: J44.7(I/O) L56.1
NetJ44_11: J44.11(I/O) L108.1
NetJ44_15: J44.15(I/O) L57.1
NetJ44_19: J44.19(I/O) L106.1
NetJ44_51: J44.51(I/O) L55.1
NetJ44_55: J44.55(I/O) L54.1
NetJ44_59: J44.59(I/O) L61.1
NetJ44_63: J44.63(I/O) L62.1
NetJ46_2: J46.2(I/O) L71.1
NetJ46_3: J46.3(I/O) L70.1
NetJ46_6: J46.6(I/O) L104.2
NetJ46_7: J46.7(I/O) L67.1
NetJ46_11: J46.11(I/O) L102.1
NetJ46_15: J46.15(I/O) L69.1
NetJ46_19: J46.19(I/O) L98.1
NetJ46_51: J46.51(I/O) L66.1
NetJ46_55: J46.55(I/O) L65.1
NetJ46_59: J46.59(I/O) L73.1
NetJ46_63: J46.63(I/O) L72.1
NetJ47_2: J47.2(I/O) L81.1
NetJ47_3: J47.3(I/O) L80.1
NetJ47_6: J47.6(I/O) L94.2
NetJ47_7: J47.7(I/O) L78.1
NetJ47_11: J47.11(I/O) L90.1
NetJ47_15: J47.15(I/O) L79.1
NetJ47_19: J47.19(I/O) L84.1
NetJ47_51: J47.51(I/O) L77.1
NetJ47_55: J47.55(I/O) L76.1
NetJ47_59: J47.59(I/O) L83.1
NetJ47_63: J47.63(I/O) L82.1
NetR347_2: R347.2 R351.2 U65.1(DIR1)
NetR348_1: R348.1 U65.14(B1)
NetR349_1: R349.1 R350.2 U65.2(DIR2)
NetR352_1: R352.1 U65.13(B2)
NetR354_1: R354.1 U65.12(B3)
NetR355_1: R355.1 U65.11(B4)
NetR356_1: R356.1 R357.2 U65.7(DIR3)
NetR358_2: R358.2 R359.1 U65.8(DIR4)
NetR361_1: R361.1 U66.14(B1)
NetR363_1: R363.1 U66.13(B2)
NetR364_1: R364.1 U66.12(B3)
NetR366_1: R366.1 U66.11(B4)
NetR367_2: R367.2 U68.1(DIR1)
NetR368_2: R368.2 U68.2(DIR2)
NetR369_1: R369.1 U68.14(B1)
NetR371_1: R371.1 U68.13(B2)
NetR373_1: R373.1 U68.12(B3)
NetR374_2: R374.2 U68.7(DIR3)
NetR375_2: R375.2 U68.8(DIR4)
NetR376_1: R376.1 U68.11(B4)
NetR378_2: R378.2 R380.1 U72.2(DIR2)
NetR379_2: R379.2 R381.2 U72.1(DIR1)
NetR382_1: R382.1 U72.14(B1)
NetR384_1: R384.1 U72.13(B2)
NetR389_1: R389.1 U72.12(B3)
NetR393_1: R393.1 U72.11(B4)
NetR395_1: R395.1 R396.2 U72.7(DIR3)
NetR397_2: R397.2 R398.1 U72.8(DIR4)
NetR399_1: R399.1 U75.14(B1)
NetR403_1: R403.1 U75.12(B3)
NetR406_1: R406.1 U75.13(B2)
NetR409_1: R409.1 U75.11(B4)
NetR411_2: R411.2 U78.2(DIR2)
NetR412_2: R412.2 U78.1(DIR1)
NetR414_1: R414.1 U78.14(B1)
NetR415_2: R415.2 U78.13(B2)
NetR417_1: R417.1 U78.12(B3)
NetR418_2: R418.2 U78.7(DIR3)
NetR419_2: R419.2 U78.8(DIR4)
NetR420_1: R420.1 U78.11(B4)
NetR421_1: R421.1 U79.14(B1)
NetR422_1: R422.1 R423.2 U79.2(DIR2)
NetR424_2: R424.2 R425.2 U79.1(DIR1)
NetR426_1: R426.1 U79.13(B2)
NetR428_1: R428.1 U79.12(B3)
NetR430_1: R430.1 U79.11(B4)
NetR431_1: R431.1 R432.2 U79.7(DIR3)
NetR433_2: R433.2 R434.1 U79.8(DIR4)
NetR435_1: R435.1 U80.14(B1)
NetR436_2: R436.2 U80.2(DIR2)
NetR437_2: R437.2 U80.1(DIR1)
NetR439_1: R439.1 U80.13(B2)
NetR441_1: R441.1 U80.12(B3)
NetR443_1: R443.1 U80.11(B4)
NetR444_1: R444.1 U81.14(B1)
NetR445_2: R445.2 U80.7(DIR3)
NetR446_2: R446.2 U80.8(DIR4)
NetR447_1: R447.1 U81.13(B2)
NetR448_1: R448.1 U81.12(B3)
NetR450_1: R450.1 U81.11(B4)
NetR453_1: R453.1 U84.14(B1)
NetR454_1: R454.1 R455.2 U84.2(DIR2)
NetR456_2: R456.2 R457.2 U84.1(DIR1)
NetR460_1: R460.1 U84.13(B2)
NetR463_1: R463.1 U84.12(B3)
NetR465_1: R465.1 U84.11(B4)
NetR467_1: R467.1 R468.2 U84.7(DIR3)
NetR469_2: R469.2 R470.1 U84.8(DIR4)
NetR472_1: R472.1 U85.14(B1)
NetR474_2: R474.2 U85.2(DIR2)
NetR475_2: R475.2 U85.1(DIR1)
NetR477_1: R477.1 U85.13(B2)
NetR478_1: R478.1 U85.12(B3)
NetR479_1: R479.1 U85.11(B4)
NetR481_1: R481.1 U86.14(B1)
NetR482_2: R482.2 U85.7(DIR3)
NetR483_2: R483.2 U85.8(DIR4)
NetR485_1: R485.1 U86.13(B2)
NetR486_1: R486.1 U86.12(B3)
NetR487_1: R487.1 U86.11(B4)
NetR488_1: R488.1 R489.2 U87.2(DIR2)
NetR490_2: R490.2 R491.2 U87.1(DIR1)
NetR492_1: R492.1 U87.14(B1)
NetR493_1: R493.1 U87.13(B2)
NetR494_1: R494.1 U87.12(B3)
NetR495_1: R495.1 U87.11(B4)
NetR496_1: R496.1 R497.2 U87.7(DIR3)
NetR498_2: R498.2 R499.1 U87.8(DIR4)
NetR500_1: R500.1 U88.14(B1)
NetR501_1: R501.1 U88.13(B2)
NetR502_1: R502.1 U88.12(B3)
NetR503_1: R503.1 U88.11(B4)
NetR504_2: R504.2 U89.1(DIR1)
NetR505_2: R505.2 U89.2(DIR2)
NetR506_1: R506.1 U89.14(B1)
NetR507_1: R507.1 U89.13(B2)
NetR508_1: R508.1 U89.12(B3)
NetR509_1: R509.1 U89.11(B4)
NetR510_2: R510.2 U89.7(DIR3)
NetR511_2: R511.2 U89.8(DIR4)
(unnamed): port Start_sDCP+, sheet S_DCDC/Start_sDCP+
(unnamed): port Start_sDCP-, sheet S_DCDC/Start_sDCP-

Not connected (* = marked no-connect by the designer): J44 34(I/O)

### Buses and harness runs
bus IO_Slow[60..1] = port IO_Slow[60..1]

### Notes on the sheet
- Labels drawn without touching a wire or pin: out7
- Подп. и дата
- Инв. № дубл.
- Взам. инв. №
- Инв. № подл.
- Изм.
- Лист
- № докум.
- Подп.
- Дата
- Копировал
- Формат А2

### Library data of the parts
C189#2 C191#2 C192#2 C193#2 C194#2 C195#2 C196#2 C201#2 C202-C209 C216 C226 C233 C234 C240 C241 C243 C244 C248 C249 C251 C252 C254 C255 = C0805: as C308 on sheet DDS; Value: 100nF; Price: 2
J44 J46 J47 = PCI_PMC_M: as J22 on sheet DDS; Value: PCI_PMC; Vendor: TE Connectivity
L54-L57 L59-L62 L65-L67 L69-L73 L76-L84 L90 L94 L98 L102 L104 L106 L108 L109 = BLM21: as L35 on sheet DDS; Price: 10; Device: BLM21
R347-R352 R354-R359 R361 R363 R364 R366-R369 R371 R373-R376 R378-R382 R384 R389 R393 R395-R399 R403 R406 R409 R411 R412 R414 R417-R426 R428 R430-R437 R439 R441 R443-R448 R450 R453-R457 R460 R463 R465 R467-R470 R472 R474 R475 R477-R479 R481-R483 R485-R511 = R0805: as R218 on sheet DDS; Price: 2
  R347 R349 R356 R359 R379 R380 R395 R398 R422 R424 R431 R434 R454 R456 R467 R470 R488 R490 R496 R499: Value: 0
  R348 R352 R354 R355 R361 R363 R364 R366 R369 R371 R373 R376 R382 R384 R389 R393 R399 R403 R406 R409 R414 R417 R420 R421 R426 R428 R430 R435 R439 R441 R443 R444 R447 R448 R450 R453 R460 R463 R465 R472 R477-R479 R481 R485-R487 R492-R495 R500-R503 R506-R509: Value: 120
  R350 R351 R357 R358 R367 R368 R374 R375 R378 R381 R396 R397 R411 R412 R418 R419 R423 R425 R432 R433 R436 R437 R445 R446 R455 R457 R468 R469 R474 R475 R482 R483 R489 R491 R497 R498 R504 R505 R510 R511: Value: 10k
R415 = R0805: as R4 on sheet DDS; Price: 2; Value: 120
U65 U66 U68 U72 U75 U78-U81 U84-U89 = SN74AVC4T774: as U29 on sheet DDS; Device: SN74AVC4T774; Price: 300

## Sheet DCDC_Slow.SchDoc
size 594 x 420 mm; Address1: Address1; Address2: Address2; Address3: Address3; Address4: Address4; SheetNumber: 1; Scale: 1:1; Разраб.: Иванов; Обозначение документа: АБВГ.123456.001 Э3; Пров.: Петров; Утв.: Сидоров; Наименование организации: ОАО "Концерн "МПО-Гидроприбор"; Перв. применение: АБВГ.123456.000; Наименование изделия 1: Плата; Наименование изделия 2: Схема электрическая; Наименование изделия 3: принципиальная; Нач. отд.: Нач. отд.; Фамилия нач. отд.: Сидоров
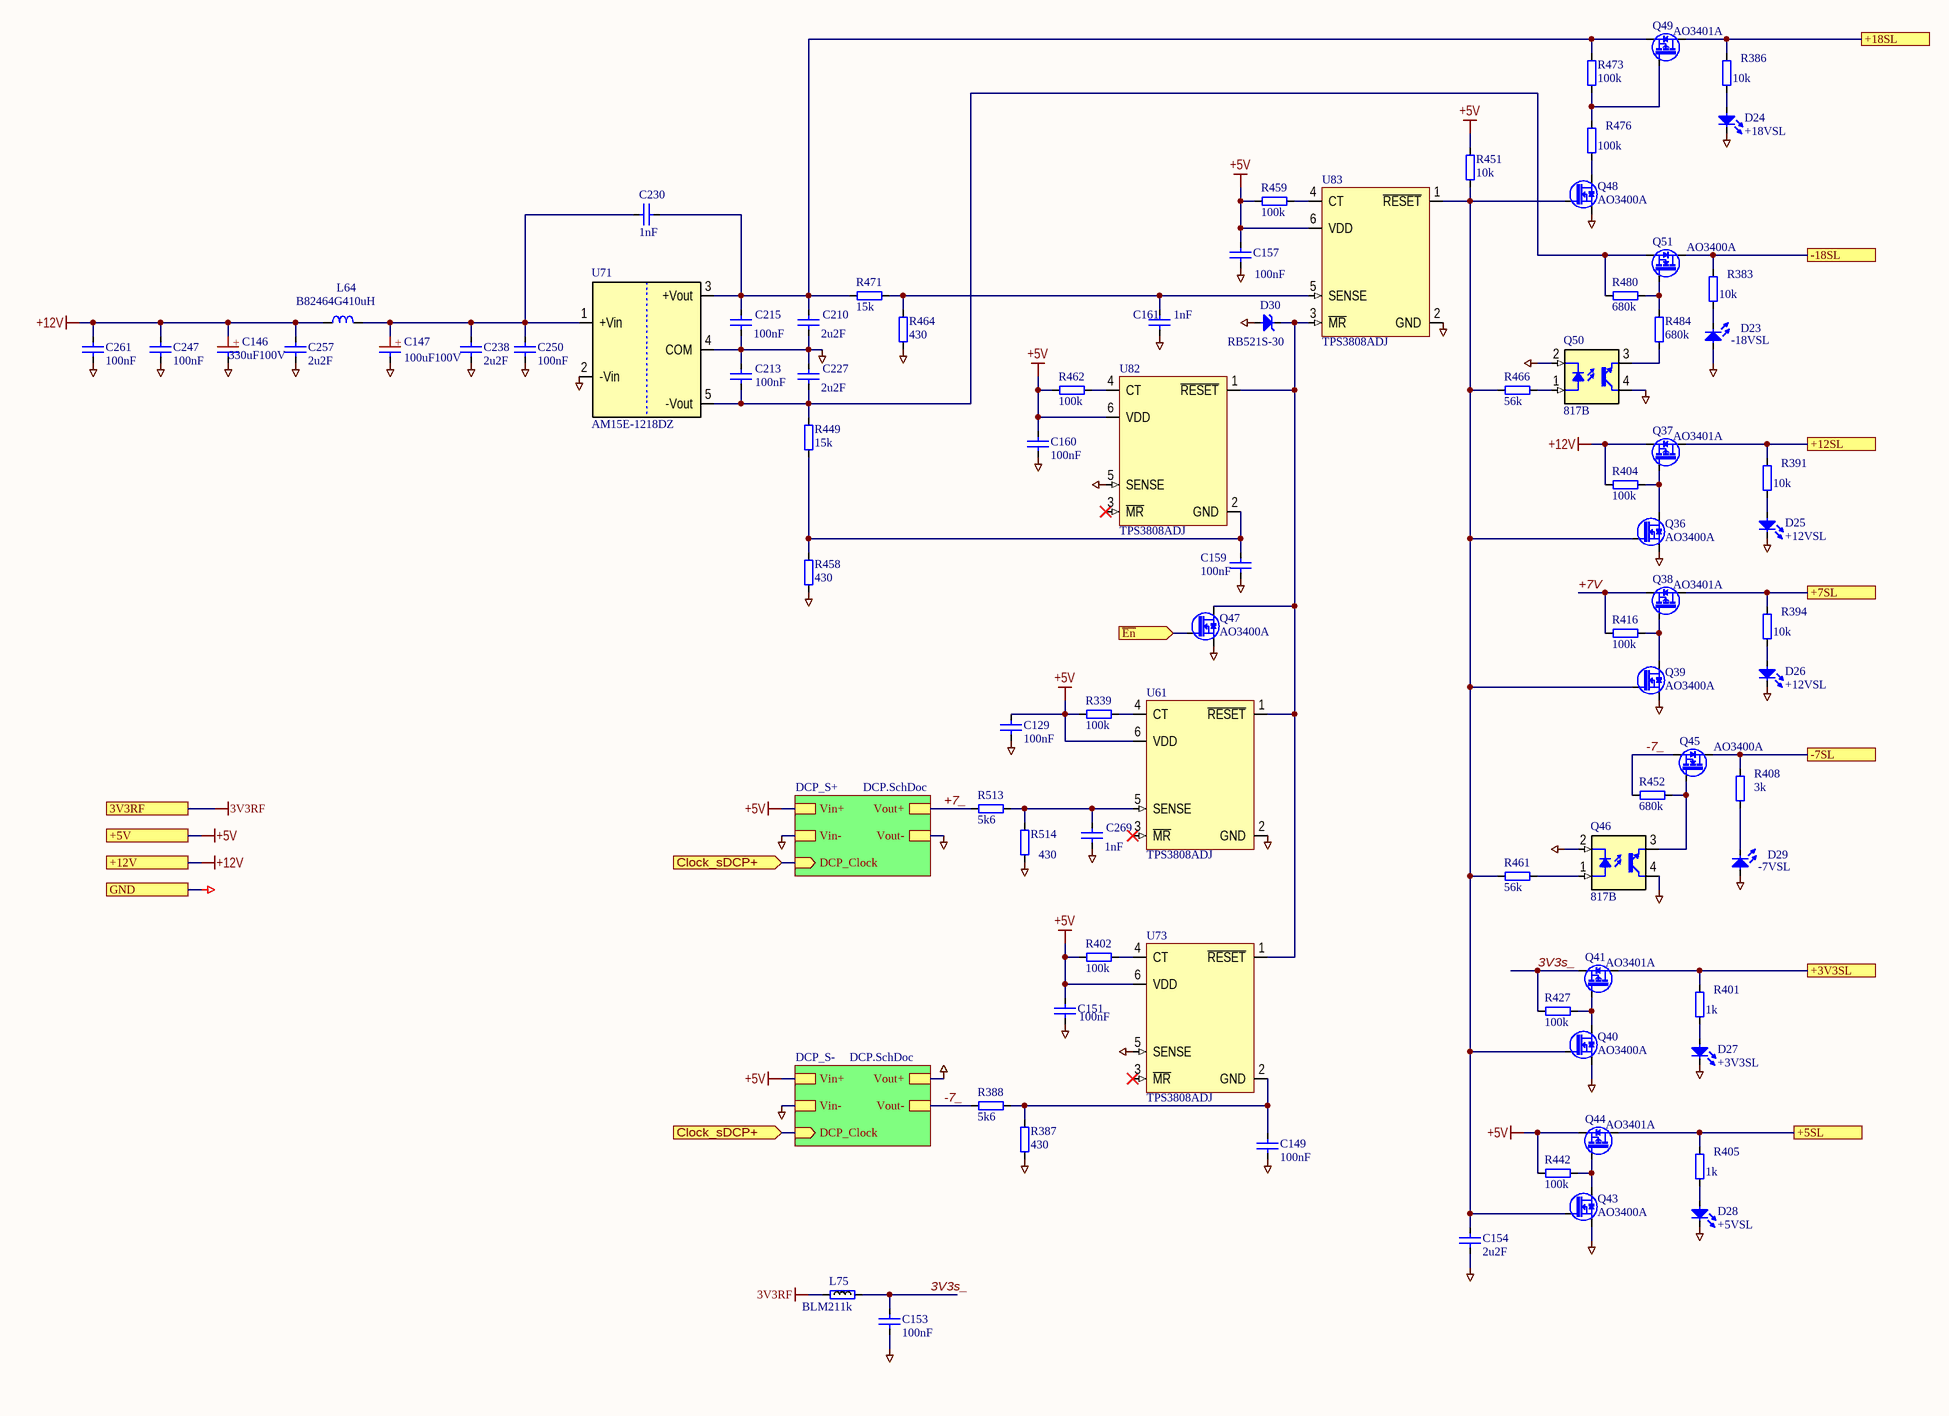
[diagram p24: DCDC_Slow.SchDoc]

### Parts
(Parts that share a designator on the sheet are numbered #1, #2 ... from top to bottom, then left to right.)
C129#2  100nF  [SMD0805CAP]
C146#2  330uF100V  [CAPPR750-1600X2000]
C147#2  100uF100V  [CAPPR500-1000X1250]
C149#2  100nF  [SMD0805CAP]
C151#2  100nF  [SMD0805CAP]
C153#2  100nF  [SMD0805CAP]
C154#2  2u2F  [SMD0805CAP]
C157#2  100nF  [SMD0805CAP]
C159#2  100nF  [SMD0805CAP]
C160  100nF  [SMD0805CAP]
C161  1nF  [SMD0805CAP]
C210  2u2F  [SMD0805CAP]
C213  100nF  [SMD0805CAP]
C215  100nF  [SMD0805CAP]
C227  2u2F  [SMD0805CAP]
C230  1nF  [SMD0805CAP]
C238  2u2F  [SMD0805CAP]
C247  100nF  [SMD0805CAP]
C250  100nF  [SMD0805CAP]
C257  2u2F  [SMD0805CAP]
C261  100nF  [SMD0805CAP]
C269  1nF  [SMD0805CAP]
D23  -18VSL  [LED0603]
D24  +18VSL  [LED0603]
D25  +12VSL  [LED0603]
D26  +12VSL  [LED0603]
D27  +3V3SL  [LED0603]
D28  +5VSL  [LED0603]
D29  -7VSL  [LED0603]
D30  RB521S-30  [SODFL1608X65N]
L64  B82464G410uH  [IND_COILCRAFT_MSS1038]
L75  BLM211k  [RESC2012X50N]
Q36  AO3400A  [SOT95P229X119-3N]
Q37  AO3401A  [SOT95P229X119-3N]
Q38  AO3401A  [SOT95P229X119-3N]
Q39  AO3400A  [SOT95P229X119-3N]
Q40  AO3400A  [SOT95P229X119-3N]
Q41  AO3401A  [SOT95P229X119-3N]
Q43  AO3400A  [SOT95P229X119-3N]
Q44  AO3401A  [SOT95P229X119-3N]
Q45  AO3400A  [SOT95P229X119-3N]
Q46  817B  [DIP4-300]
Q47  AO3400A  [SOT95P229X119-3N]
Q48  AO3400A  [SOT95P229X119-3N]
Q49  AO3401A  [SOT95P229X119-3N]
Q50  817B  [DIP4-300]
Q51  AO3400A  [SOT95P229X119-3N]
R339  100k  [SMD0805RES]
R383  10k  [SMD0805RES]
R386  10k  [SMD0805RES]
R387  430  [SMD0805RES]
R388  5k6  [SMD0805RES]
R391  10k  [SMD0805RES]
R394  10k  [SMD0805RES]
R401  1k  [SMD0805RES]
R402  100k  [SMD0805RES]
R404  100k  [SMD0805RES]
R405  1k  [SMD0805RES]
R408  3k  [SMD0805RES]
R416  100k  [SMD0805RES]
R427  100k  [SMD0805RES]
R442  100k  [SMD0805RES]
R449  15k  [SMD0805RES]
R451  10k  [SMD0805RES]
R452  680k  [SMD0805RES]
R458  430  [SMD0805RES]
R459  100k  [SMD0805RES]
R461  56k  [SMD0805RES]
R462  100k  [SMD0805RES]
R464  430  [SMD0805RES]
R466  56k  [SMD0805RES]
R471  15k  [SMD0805RES]
R473  100k  [SMD0805RES]
R476  100k  [SMD0805RES]
R480  680k  [SMD0805RES]
R484  680k  [SMD0805RES]
R513  5k6  [SMD0805RES]
R514  430  [SMD0805RES]
U61  TPS3808ADJ  [SOT95P270X145-6N]
U71  AM15E-1218DZ  [DCDC_Aimtec_Dual]
U73  TPS3808ADJ  [SOT95P270X145-6N]
U82  TPS3808ADJ  [SOT95P270X145-6N]
U83  TPS3808ADJ  [SOT95P270X145-6N]

### Sub-sheets
DCP_S+ = DCP.SchDoc: DCP_Clock (in), Vout+, Vout-, Vin-, Vin+
DCP_S- = DCP.SchDoc: DCP_Clock (in), Vout+, Vout-, Vin-, Vin+

### Ports
3V3RF, +3V3SL, +5SL, +5V, +7SL, +12SL, +12V, +18SL, -7SL, -18SL, Clock_sDCP+ (in), GND, ~{En} (in)

### Nets
3V3RF: L75.2 ; port 3V3RF
+5V: C129#2.2 C151#2.2 C157#2.2 C160.2 Q44.2(S) R339.1 R402.1 R442.2 R451.1 R459.1 R462.1 U61.6(VDD) U73.6(VDD) U82.6(VDD) U83.6(VDD) ; port +5V, sheet DCP_S+/Vin+, sheet DCP_S-/Vin+  [project net +5VME]
+12V: C146#2.1(+) C247.2 C257.2 C261.2 L64.1 Q37.2(S) R404.2 ; port +12V  [project net +12Vin]
GND: C129#2.1 C146#2.2 C147#2.2 C149#2.2 C151#2.1 C153#2.1 C154#2.2 C157#2.1 C159#2.2 C160.1 C161.1 C210.1 C213.1 C215.2 C227.2 C238.1 C247.1 C250.2 C257.1 C261.1 C269.1 D23.2(A) D24.1(C) D25.1(C) D26.1(C) D27.1(C) D28.1(C) D29.2(A) D30.2(A) Q36.2(S) Q39.2(S) Q40.2(S) Q43.2(S) Q46.2(C) Q46.4(C) Q47.2(S) Q48.2(S) Q50.2(C) Q50.4(C) R387.1 R458.1 R464.1 R514.2 U61.2(GND) U71.2(-Vin) U71.4(COM) U73.5(SENSE) U82.5(SENSE) U83.2(GND) ; port GND, sheet DCP_S+/Vout-, sheet DCP_S+/Vin-, sheet DCP_S-/Vout+, sheet DCP_S-/Vin-  [project net POK_int]
3V3s_: C153#2.2 L75.1 Q41.2(S) R427.2
3V3SL: Q41.3(D) R401.2 ; port +3V3SL
+5SL: Q44.3(D) R405.2 ; port +5SL
+7_: R513.2 ; sheet DCP_S+/Vout+
+7SL: Q38.3(D) R394.2 ; port +7SL
+7V: Q38.2(S) R416.2
+12SL: Q37.3(D) R391.2 ; port +12SL
+18SL: Q51.3(D) R383.2 ; port -18SL
-7_: Q45.2(S) R388.1 R452.2 ; sheet DCP_S-/Vout-
-7SL: Q45.3(D) R408.2 ; port -7SL
-18SL: Q49.3(D) R386.2 ; port +18SL
~{En}: Q47.1(G) ; port ~{En}
NetC147#2_1: C147#2.1(+) C230.1 C238.2 C250.1 L64.2 U71.1(+Vin)
NetC149#2_1: C149#2.1 R387.2 R388.2 U73.2(GND)
NetC154#2_1: C154#2.1 Q36.1(G) Q39.1(G) Q40.1(G) Q43.1(G) Q48.1(G) R451.2 R461.1 R466.1 U83.1(~{RESET})
NetC159#2_1: C159#2.1 R449.2 R458.2 U82.2(GND)
NetC161_2: C161.2 R464.2 R471.1 U83.5(SENSE)
NetC210_2: C210.2 C215.1 C230.2 Q49.2(S) R471.2 R473.1 U71.3(+Vout)
NetC213_2: C213.2 C227.1 Q51.2(S) R449.1 R480.2 U71.5(-Vout)
NetC269_2: C269.2 R513.1 R514.1 U61.5(SENSE)
NetD23_1: D23.1(C) R383.1
NetD24_2: D24.2(A) R386.1
NetD25_2: D25.2(A) R391.1
NetD26_2: D26.2(A) R394.1
NetD27_2: D27.2(A) R401.1
NetD28_2: D28.2(A) R405.1
NetD29_1: D29.1(C) R408.1
NetD30_1: D30.1(C) Q47.3(D) U61.1(~{RESET}) U73.1(~{RESET}) U82.1(~{RESET}) U83.3(~{MR})
NetQ10_DCP_S+_1: port Clock_sDCP+, sheet DCP_S+/DCP_Clock, sheet DCP_S-/DCP_Clock
NetQ36_3: Q36.3(D) Q37.1(G) R404.1
NetQ38_1: Q38.1(G) Q39.3(D) R416.1
NetQ40_3: Q40.3(D) Q41.1(G) R427.1
NetQ43_3: Q43.3(D) Q44.1(G) R442.1
NetQ45_1: Q45.1(G) Q46.3(E) R452.1
NetQ46_1: Q46.1(A) R461.2
NetQ48_3: Q48.3(D) R476.1
NetQ49_1: Q49.1(G) R473.2 R476.2
NetQ50_1: Q50.1(A) R466.2
NetQ50_3: Q50.3(E) R484.1
NetQ51_1: Q51.1(G) R480.1 R484.2
NetR339_2: R339.2 U61.4(CT)
NetR402_2: R402.2 U73.4(CT)
NetR459_2: R459.2 U83.4(CT)
NetR462_2: R462.2 U82.4(CT)

Not connected (* = marked no-connect by the designer): U61 3(~{MR})*; U73 3(~{MR})*; U82 3(~{MR})*

### Notes on the sheet
- Подп. и дата
- Инв. № дубл.
- Взам. инв. №
- Инв. № подл.
- Изм.
- Лист
- № докум.
- Подп.
- Дата
- Копировал
- Формат А2

### Library data of the parts
C129#2 C149#2 C151#2 C153#2 C154#2 C157#2 C159#2 C160 C161 C210 C213 C215 C227 C230 C238 C247 C250 C257 C261 C269 = C0805: as C308 on sheet DDS; Price: 2
  C129#2 C149#2 C151#2 C153#2 C157#2 C159#2 C160 C213 C215 C247 C250 C261: Value: 100nF
  C154#2 C210 C227 C238 C257: Value: 2u2F
  C161 C230 C269: Value: 1nF
C146#2 = CAP_POL_7_5x16: Конденсатор полярный d16 p7.5мм; Voltage: 100V; Vendor: Vishay; Value: 330uF; SMD Solders: 0; Solder Option: RM; Tolerance: 20%; Pkg: 7.5x16mm; Device: Cap+; THD Solders: 2; Price: 30
C147#2 = CAP_POL_5x10: Конденсатор полярный d10 p5мм; Voltage: 100V; Vendor: Vishay; Value: 100uF; SMD Solders: 0; Solder Option: RM; Tolerance: 20%; Pkg: 5x10mm; Device: Cap+; THD Solders: 2; Price: 20
D23-D29 = LED0603: as D12 on sheet DCDC_DDS; Price: 10; Device: LED0603
  D23: Value: -18VSL
  D24: Value: +18VSL
  D25 D26: Value: +12VSL
  D27: Value: +3V3SL
  D28: Value: +5VSL
  D29: Value: -7VSL
D30 = RB521S-30: as D13 on sheet DCDC_DDS; Price: 5; Device: RB521S-30; Name to order: RB521S-30
L64 = B82464G4: SMD Дроссель; Vendor: Epcos; Value: 10uH; Voltage: 2; Solder Option: RM; Tolerance: 20%; Pkg: SMD10.4x10.4mm; THD Solders: 0; Name to order: B82464G4103M; Current: 3A5; Price: 400; SMD Solders: 2; Device: B82464G4
L75 = BLM21: as L35 on sheet DDS; Price: 10; Device: BLM21
Q36 Q39 Q40 Q43 Q45 Q47 Q48 Q51 = AO3400A: as Q15-Q17 on sheet DCDC_DDS; Price: 10; Device: AO3400A; Name to order: AO3400A
Q37 Q38 Q41 Q44 Q49 = AO3401A: as Q19 on sheet DCDC_DDS; Price: 10; Device: AO3401A; Name to order: AO3401A
Q46 Q50 = 817B: as Q14 on sheet DCDC_DDS; Device: 817B; Price: 10; Name to order: 817B; Current: 0
R339 R383 R386-R388 R391 R394 R401 R402 R404 R405 R408 R416 R427 R442 R449 R451 R452 R458 R459 R461 R462 R464 R466 R471 R473 R476 R480 R484 R513 R514 = R0805: as R4 on sheet DDS; Price: 2
  R339 R402 R404 R416 R427 R442 R459 R462 R473 R476: Value: 100k
  R383 R386 R391 R394 R451: Value: 10k
  R387 R458 R464 R514: Value: 430
  R388 R513: Value: 5k6
  R401 R405: Value: 1k
  R408: Value: 3k
  R449 R471: Value: 15k
  R452 R480 R484: Value: 680k
  R461 R466: Value: 56k
U61 U73 U82 U83 = TPS3808: as U30#2 on sheet DCDC_DDS; Price: 200; Device: TPS3808
U71 = AM15E-: DC-DC+&-Halvoisolated out; Vendor: Aimtec; Value: 1218DZ; Pkg: DCDC_5; SMD Solders: 0; Solder Option: RM; THD Solders: 5; Name to order: AM15-1218DZ; Price: 2000; Device: AM15E-